# Altium project Dragonflyte.PrjPcb (part 1 of 2)
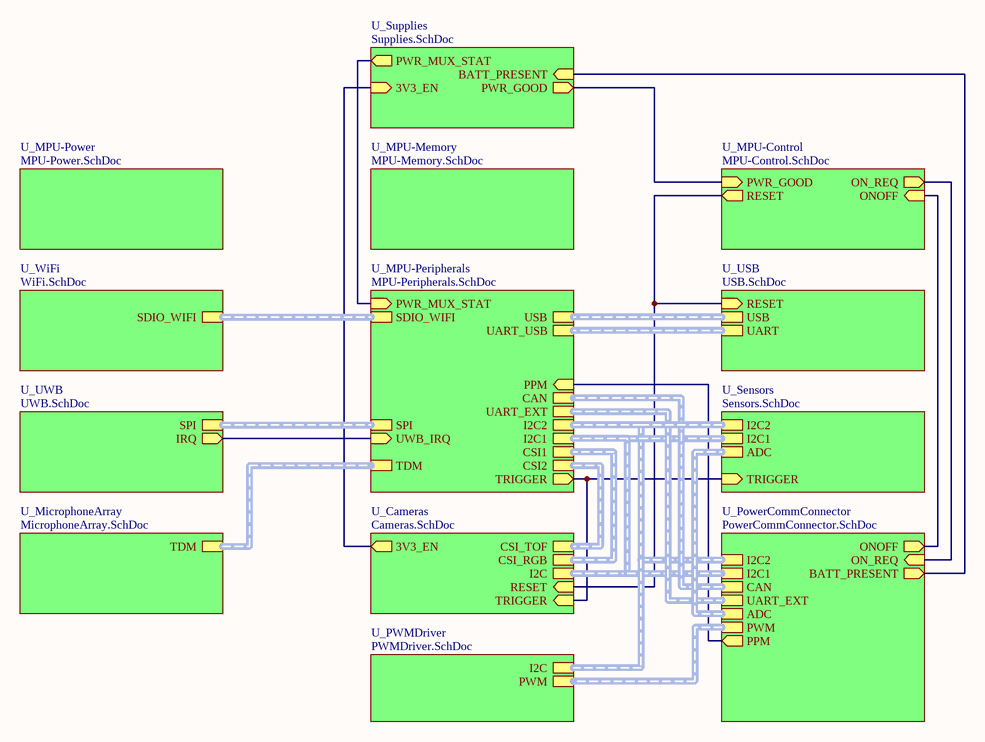
[diagram p0: Dragonflyte.SchDoc]
13 sheets, 238 parts. Net scope: hierarchical (ports join the sheet entries above them; power ports are global).
Board file: Dragonflyte.PcbDoc
Sheets:
  Dragonflyte.SchDoc
    U_Supplies = Supplies.SchDoc
    U_MPU-Memory = MPU-Memory.SchDoc
    U_MPU-Control = MPU-Control.SchDoc
    U_MPU-Peripherals = MPU-Peripherals.SchDoc
    U_WiFi = WiFi.SchDoc
    U_USB = USB.SchDoc
    U_Sensors = Sensors.SchDoc
    U_UWB = UWB.SchDoc
    U_MicrophoneArray = MicrophoneArray.SchDoc
    U_Cameras = Cameras.SchDoc
    U_PowerCommConnector = PowerCommConnector.SchDoc
    U_PWMDriver = PWMDriver.SchDoc

## Sheet Dragonflyte.SchDoc
size A; DocumentNumber: 1; SheetNumber: 1

### Sub-sheets
U_Cameras = Cameras.SchDoc: CSI_TOF (harness CSI12), I2C (harness I2C), CSI_RGB (harness CSI12), RESET (in), TRIGGER (in), 3V3_EN (out)
U_MicrophoneArray = MicrophoneArray.SchDoc: TDM (harness TDM)
U_MPU-Control = MPU-Control.SchDoc: PWR_GOOD (in), RESET (out), ON_REQ (out), ONOFF (in)
U_MPU-Memory = MPU-Memory.SchDoc: no entries
U_MPU-Peripherals = MPU-Peripherals.SchDoc: SDIO_WIFI (harness SDIO), UART_USB (harness UART), USB (harness USB), TDM (harness TDM), SPI (harness SPI), CSI1 (harness CSI12), I2C2 (harness I2C), I2C1 (harness I2C), CSI2 (harness CSI12), UWB_IRQ (in), PWR_MUX_STAT (in), TRIGGER (out), UART_EXT (harness UART), CAN (harness CAN), PPM (in)
U_MPU-Power = MPU-Power.SchDoc (file not in this document): no entries
U_PowerCommConnector = PowerCommConnector.SchDoc: ONOFF (out), ON_REQ (in), I2C1 (harness I2C), I2C2 (harness I2C), BATT_PRESENT (out), UART_EXT (harness UART), CAN (harness CAN), ADC (harness ADC), PWM (harness PWM), PPM (out)
U_PWMDriver = PWMDriver.SchDoc: I2C (harness I2C), PWM (harness PWM)
U_Sensors = Sensors.SchDoc: I2C1 (harness I2C), I2C2 (harness I2C), ADC (harness ADC), TRIGGER (in)
U_Supplies = Supplies.SchDoc: PWR_GOOD (out), PWR_MUX_STAT (out), BATT_PRESENT (in), 3V3_EN (in)
U_USB = USB.SchDoc: RESET (in), USB (harness USB), UART (harness UART)
U_UWB = UWB.SchDoc: SPI (harness SPI), IRQ (out)
U_WiFi = WiFi.SchDoc: SDIO_WIFI (harness SDIO)

### Nets
PWR_GOOD: sheet U_Supplies/PWR_GOOD, sheet U_MPU-Control/PWR_GOOD
RESET: sheet U_MPU-Control/RESET, sheet U_USB/RESET, sheet U_Cameras/RESET
TRIGGER: sheet U_MPU-Peripherals/TRIGGER, sheet U_Sensors/TRIGGER, sheet U_Cameras/TRIGGER
NetJP3_6: sheet U_Supplies/BATT_PRESENT, sheet U_PowerCommConnector/BATT_PRESENT
NetJP3_11: sheet U_MPU-Peripherals/PPM, sheet U_PowerCommConnector/PPM
NetJP3_30: sheet U_MPU-Control/ON_REQ, sheet U_PowerCommConnector/ON_REQ
NetJP3_31: sheet U_MPU-Control/ONOFF, sheet U_PowerCommConnector/ONOFF
NetR38_1: sheet U_Supplies/PWR_MUX_STAT, sheet U_MPU-Peripherals/PWR_MUX_STAT
NetU1_A16: sheet U_MPU-Peripherals/UWB_IRQ, sheet U_UWB/IRQ
NetU7_9: sheet U_Supplies/3V3_EN, sheet U_Cameras/3V3_EN

### Buses and harness runs
harness sheet U_Cameras/CSI_RGB = sheet U_MPU-Peripherals/CSI1
harness sheet U_Cameras/CSI_TOF = sheet U_MPU-Peripherals/CSI2
harness sheet U_Cameras/I2C = sheet U_MPU-Peripherals/I2C1 = sheet U_PowerCommConnector/I2C1 = sheet U_Sensors/I2C1
harness sheet U_MicrophoneArray/TDM = sheet U_MPU-Peripherals/TDM
harness sheet U_MPU-Peripherals/CAN = sheet U_PowerCommConnector/CAN
harness sheet U_MPU-Peripherals/I2C2 = sheet U_PowerCommConnector/I2C2 = sheet U_PWMDriver/I2C = sheet U_Sensors/I2C2
harness sheet U_MPU-Peripherals/SDIO_WIFI = sheet U_WiFi/SDIO_WIFI
harness sheet U_MPU-Peripherals/SPI = sheet U_UWB/SPI
harness sheet U_MPU-Peripherals/UART_EXT = sheet U_PowerCommConnector/UART_EXT
harness sheet U_MPU-Peripherals/UART_USB = sheet U_USB/UART
harness sheet U_MPU-Peripherals/USB = sheet U_USB/USB
harness sheet U_PowerCommConnector/ADC = sheet U_Sensors/ADC
harness sheet U_PowerCommConnector/PWM = sheet U_PWMDriver/PWM

## Sheet Supplies.SchDoc
size A; DocumentNumber: 6; SheetNumber: 6
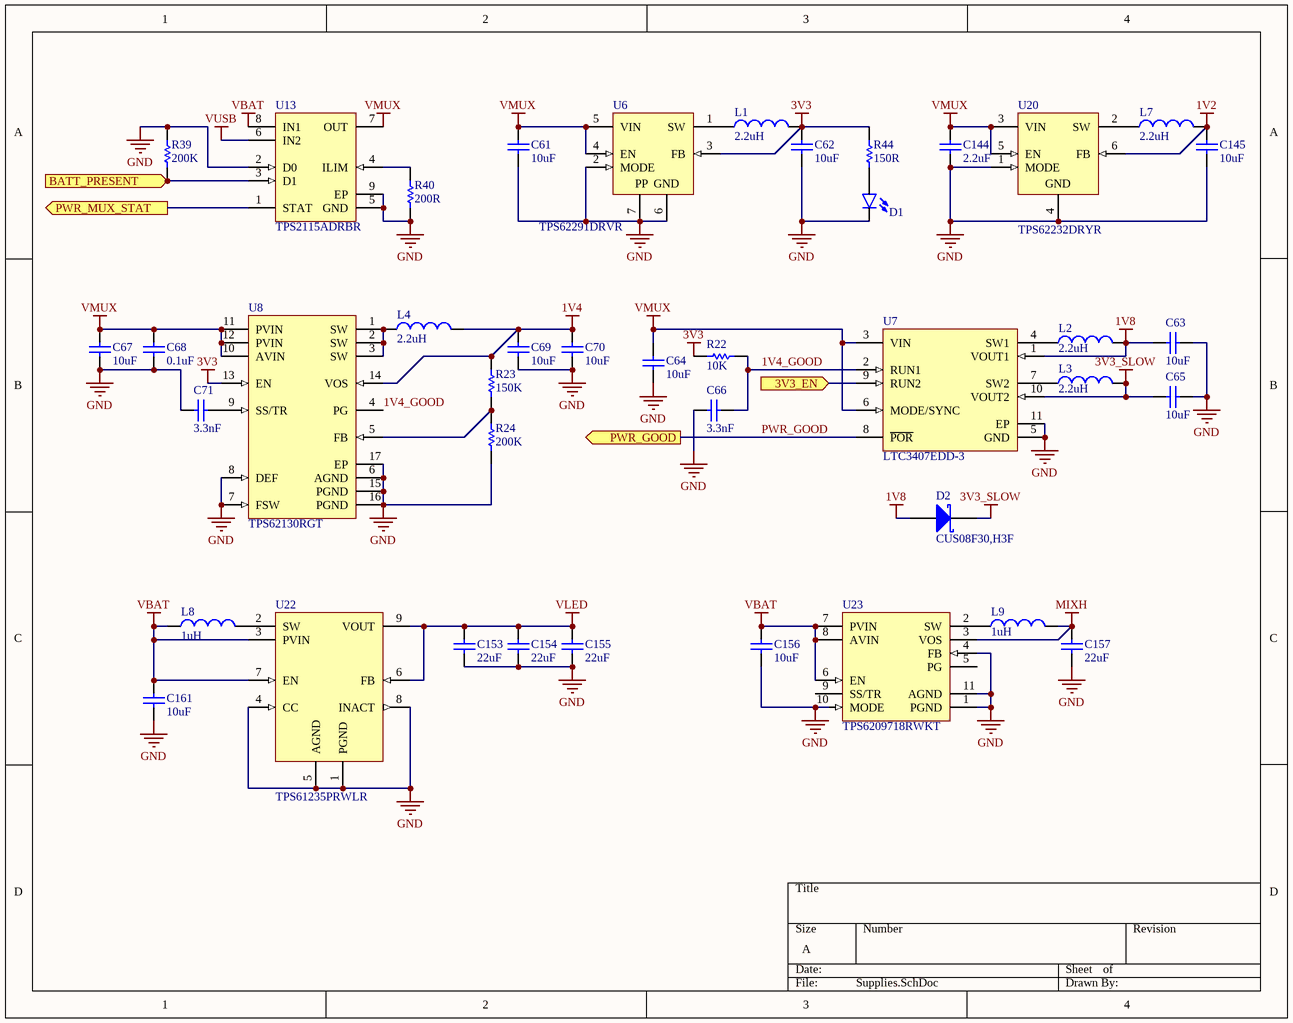
[diagram p1: Supplies.SchDoc]

### Parts
C61  value 10uF  [C0402[1005X55]]  (hidden comment: 10uF 6.3V 0402)
C62  value 10uF  [C0402[1005X55]]  (hidden comment: 10uF 6.3V 0402)
C63  value 10uF  [C0402[1005X55]]  (hidden comment: 10uF 6.3V 0402)
C64  value 10uF  [C0402[1005X55]]  (hidden comment: 10uF 6.3V 0402)
C65  value 10uF  [C0402[1005X55]]  (hidden comment: 10uF 6.3V 0402)
C66  value 3.3nF  [C0402[1005X55]]  (hidden comment: 3.3nF 50V 0402)
C67  value 10uF  [C0402[1005X55]]  (hidden comment: 10uF 6.3V 0402)
C68  value 0.1uF  [C0402[1005X55]]  (hidden comment: 0.1uF 6.3V 0402)
C69  value 10uF  [C0402[1005X55]]  (hidden comment: 10uF 6.3V 0402)
C70  value 10uF  [C0402[1005X55]]  (hidden comment: 10uF 6.3V 0402)
C71  value 3.3nF  [C0402[1005X55]]  (hidden comment: 3.3nF 50V 0402)
C144  value 2.2uF  [C0402[1005X55]]  (hidden comment: 2.2uF 6.3V 0402)
C145  value 10uF  [C0402[1005X55]]  (hidden comment: 10uF 6.3V 0402)
C153  value 22uF  [C0603[1608X92]]  (hidden comment: 22uF 6.3V 0603)
C154  value 22uF  [C0603[1608X92]]  (hidden comment: 22uF 6.3V 0603)
C155  value 22uF  [C0603[1608X92]]  (hidden comment: 22uF 6.3V 0603)
C156  value 10uF  [C0402[1005X55]]  (hidden comment: 10uF 6.3V 0402)
C157  value 22uF  [C0603[1608X92]]  (hidden comment: 22uF 6.3V 0603)
C161  value 10uF  [C0402[1005X55]]  (hidden comment: 10uF 6.3V 0402)
D1  LED_0603_BLUE_5mA  [LED0603]  (value not drawn)
D2  CUS08F30,H3F  [SOD-323]
L1  2.2uH  [IND0805]
L2  2.2uH  [IND0603]
L3  2.2uH  [IND0603]
L4  2.2uH  [IND1008]
L7  2.2uH  [IND0603]
L8  1uH  [IND1008]
L9  1uH  [IND0805]
R22  value 10K  [R0402[1005]]  (hidden comment: 10K 1% 0402)
R23  value 150K  [R0402[1005]]  (hidden comment: 150K 1% 0402)
R24  value 200K  [R0402[1005]]  (hidden comment: 200K 1% 0402)
R39  value 200K  [R0402[1005]]  (hidden comment: 200K 1% 0402)
R40  value 200R  [R0402[1005]]  (hidden comment: 200R 1% 0402)
R44  value 150R  [R0402[1005]]  (hidden comment: 150R 1% 0402)
U6  TPS62291DRVR  [WSON-6]
U7  LTC3407EDD-3  [VSON-10 (3mmx3mm)]
U8  TPS62130RGT  [QFN-16]
U13  TPS2115ADRBR  [VSON-8 (3x3MM)]
U20  TPS62232DRYR  [USON-6]
U22  TPS61235PRWLR  [VQFN-9]
U23  TPS6209718RWKT  [VQFN-11]

### Ports
3V3_EN (in), BATT_PRESENT (in), PWR_GOOD (out), PWR_MUX_STAT (out)

### Nets
1V2: C145.2 L7.2 U20.6(FB)
1V4: C69.2 C70.2 L4.2 R23.2 U8.14(VOS)
1V8: C63.2 D2.2(A) L2.2 U7.1(VOUT1)
3V3: C62.2 L1.2 R22.1 R44.2 U6.3(FB) U8.13(EN)
3V3_SLOW: C65.1 D2.1(K) L3.2 U7.10(VOUT2)
GND: C61.1 C62.1 C63.1 C64.1 C65.2 C66.1 C67.1 C68.1 C69.1 C70.1 C71.1 C144.1 C145.1 C153.1 C154.1 C155.1 C156.1 C157.1 C161.1 D1.C R24.1 R39.2 R40.1 U6.2(MODE) U6.6(GND) U6.7(EP) U7.5(GND) U7.11(EP) U8.6(AGND) U8.7(FSW) U8.8(DEF) U8.15(PGND) U8.16(PGND) U8.17(EP) U13.2(D0) U13.5(GND) U13.9(EP) U20.1(MODE) U20.4(GND) U22.1(PGND) U22.4(CC) U22.5(AGND) U22.8(INACT) U23.1(PGND) U23.4(FB) U23.10(MODE) U23.11(AGND)
MIXH: C157.2 L9.2 U23.3(VOS)
VBAT: C156.2 C161.2 L8.1 U13.8(IN1) U22.3(PVIN) U22.7(EN) U23.6(EN) U23.7(PVIN) U23.8(AVIN)
VLED: C153.2 C154.2 C155.2 U22.6(FB) U22.9(VOUT)
VMUX: C61.2 C64.2 C67.2 C68.2 C144.2 U6.4(EN) U6.5(VIN) U7.3(VIN) U7.6(MODE/SYNC) U8.10(AVIN) U8.11(PVIN) U8.12(PVIN) U13.7(OUT) U20.3(VIN) U20.5(EN)
VUSB: U13.6(IN2)
1V4_GOOD: C66.2 R22.2 U7.2(RUN1) U8.4(PG)
PWR_GOOD: U7.8(~{POR}) ; port PWR_GOOD
NetC71_2: C71.2 U8.9(SS/TR)
NetD1_A: D1.A R44.1
NetJP3_6: R39.1 U13.3(D1) ; port BATT_PRESENT
NetL1_1: L1.1 U6.1(SW)
NetL2_1: L2.1 U7.4(SW1)
NetL3_1: L3.1 U7.7(SW2)
NetL4_1: L4.1 U8.1(SW) U8.2(SW) U8.3(SW)
NetL7_1: L7.1 U20.2(SW)
NetL8_2: L8.2 U22.2(SW)
NetL9_1: L9.1 U23.2(SW)
NetR23_1: R23.1 R24.2 U8.5(FB)
NetR38_1: U13.1(STAT) ; port PWR_MUX_STAT
NetR40_2: R40.2 U13.4(ILIM)
NetU7_9: U7.9(RUN2) ; port 3V3_EN

Not connected (* = marked no-connect by the designer): U23 5(PG) 9(SS/TR)

### Notes on the sheet
- (in symbol TPS62291DRVR) PP

### Library data of the parts
C61-C65 C67 C69 C70 C145 C156 C161 = CAP_10uF_6.3V_0402_20%: 10uF 6.3V 20% 0402 (1005 Metric); PartNumber: GRM155R60J106ME44D; Manufacturer: Murata; Tolerance: 20%; Mounting Technology: Surface Mount; PackageReference: 0402; PackageDescription: 0402 (1005 Metric); Voltage: 6.3V
C66 C71 = CAP_3.3nF_50V_0402_10%: 3.3nF 50V 10% 0402 (1005 Metric); PartNumber: GRM155R71H332KA01D; Manufacturer: Murata; Mounting Technology: Surface Mount; PackageReference: 0402; PackageDescription: 0402 (1005 Metric); Voltage: 50V; Tolerance: 10%
C68 = CAP_0.1uF_6.3V_0402_10%: 0.1uF 6.3V 10% 0402 (1005 Metric); PartNumber: GRM155R70J104KA01D; Manufacturer: Murata; Mounting Technology: Surface Mount; PackageReference: 0402; PackageDescription: 0402 (1005 Metric); Voltage: 6.3V; Tolerance: 10%
C144 = CAP_2.2uF_6.3V_0402_20%: 2.2uF 6.3V 20% 0402 (1005 Metric); PartNumber: GRM155R60J225ME15D; Manufacturer: Murata; Mounting Technology: Surface Mount; PackageReference: 0402; PackageDescription: 0402 (1005 Metric); Voltage: 6.3V; Tolerance: 20%
C153-C155 C157 = CAP_22uF_6.3V_0603_10%: 22uF 6.3V 10% 0603 (1608 Metric); PartNumber: GRT188R60J226ME13D; Manufacturer: Murata; Mounting Technology: Surface Mount; PackageReference: 0603; PackageDescription: 0603 (1608 Metric); Voltage: 6.3V; Tolerance: 10%
D1 = LED_0603_BLUE_5mA: PartNumber: LTST-C193TBKT-5A; Manufacturer: Lite-On Inc.; PackageReference: 0603; PackageDescription: 0603 (1608 Metric); Mounting Technology: Surface Mount
D2 = CUS08F30,H3F: Manufacturer: Toshiba; PackageReference: SOD-323; PartNumber: CUS08F30,H3F; Mounting Technology: Surface Mount
L1 = IND_2.2uH_1.7A_0805_20%: 2.2uH 20% 1.7A 0805; PartNumber: LQM21PN2R2MGHL; Manufacturer: Murata; PackageReference: 0805; PackageDescription: 0805 (2012 metric); Value: 2.2uH; Mounting Technology: Surface Mount; Current: 1.7A
L2 L3 L7 = IND_2.2uH_750mA_0603_20%: 2.2uH 20% 750mA 0603; PartNumber: LQM18PZ2R2MCHD; Manufacturer: Murata; PackageReference: 0603; PackageDescription: 0603 (1608 metric); Value: 2.2uH; Mounting Technology: Surface Mount; Current: 750mA
L4 = IND_2.2uH_3.3A_1008_20%: 2.2uH 20% 3.3A 1008; PartNumber: DFE252012F-2R2M=P2; Manufacturer: Murata; PackageReference: 1008; PackageDescription: 1008 (2520 metric); Mounting Technology: Surface Mount; Current: 3.3A; Value: 2.2uH
L8 = IND_1uH_4.7A_1008_20%: 1uH 20% 4.7A 1008; PartNumber: DFE252012F-2R2M=P2; Manufacturer: Murata; PackageReference: 1008; PackageDescription: 1008 (2520 metric); Mounting Technology: Surface Mount; Current: 4.7A; Value: 1uH
L9 = IND_1uH_2.3A_0805_20%: 1uH 20% 2.3A 0805; PartNumber: DFE201210S-1R0M=P2; Manufacturer: Murata; PackageReference: 0805; PackageDescription: 0805 (2012 metric); Mounting Technology: Surface Mount; Current: 2.3A; Value: 1uH
R22 = RES_10K_0402_1%: 10K 0.063W 1% 0402 (1005 Metric); Manufacturer: KOA Speer; PartNumber: RK73H1ETTP1002F; Tolerance: 1%; Power: 0.063W; Mounting Technology: Surface Mount; PackageReference: 0402; PackageDescription: 0402 (1005 Metric); ComponentLink1Description: Datasheet; ComponentLink1URL: http://www.koaspeer.com/catimages/Products/RK73H/RK73H.pdf
R23 = RES_150K_0402_1%: 150K 0.063W 1% 0402 (1005 Metric); Manufacturer: KOA Speer; PartNumber: RK73H1ETTP1503F; Tolerance: 1%; Power: 0.063W; Mounting Technology: Surface Mount; PackageReference: 0402; PackageDescription: 0402 (1005 Metric); ComponentLink1Description: Datasheet; ComponentLink1URL: http://www.koaspeer.com/catimages/Products/RK73H/RK73H.pdf
R24 R39 = RES_200K_0402_1%: 200K 0.063W 1% 0402 (1005 Metric); Manufacturer: KOA Speer; PartNumber: RK73H1ETTP2003F; Tolerance: 1%; Power: 0.063W; Mounting Technology: Surface Mount; PackageReference: 0402; PackageDescription: 0402 (1005 Metric); ComponentLink1Description: Datasheet; ComponentLink1URL: http://www.koaspeer.com/catimages/Products/RK73H/RK73H.pdf
R40 = RES_200R_0402_1%: 200R 0.063W 1% 0402 (1005 Metric); Manufacturer: KOA Speer; PartNumber: RK73H1ETTP2000F; Tolerance: 1%; Power: 0.063W; Mounting Technology: Surface Mount; PackageReference: 0402; PackageDescription: 0402 (1005 Metric); ComponentLink1Description: Datasheet; ComponentLink1URL: http://www.koaspeer.com/catimages/Products/RK73H/RK73H.pdf
R44 = RES_150R_0402_1%: 150R 0.063W 1% 0402 (1005 Metric); Manufacturer: KOA Speer; PartNumber: RK73H1ETTP1500F; Tolerance: 1%; Power: 0.063W; Mounting Technology: Surface Mount; PackageReference: 0402; PackageDescription: 0402 (1005 Metric); ComponentLink1Description: Datasheet; ComponentLink1URL: http://www.koaspeer.com/catimages/Products/RK73H/RK73H.pdf
U6 = TPS62291DRVR: Voltage Regulators - Switching Regulators 2.25MHz 1A Step-Down Cnvrtr 3.3V Output; Manufacturer: Texas Instruments; PartNumber: TPS62291DRVR; PackageReference: WSON-6; PackageDescription: SON, 6-Leads, Body 2x2mm, Pitch 0.65mm, Thermal Pad 1.6x1mm, TI Recommended; Mounting Technology: Surface Mount
U7 = LTC3407EDD-3: Manufacturer: Linear Technology; PartNumber: LTC3407EDD-3; PackageReference: SON-10; Mounting Technology: Surface Mount
U8 = TPS62130RGT: Manufacturer: Texas Instruments; PartNumber: TPS62130RGT; PackageReference: QFN-16; Mounting Technology: Surface Mount
U13 = TPS2115ADRBR: Power Switch ICs - Power Distribution Autoswitching Pwr Mux; Manufacturer: Texas Instruments; PartNumber: TPS2115ADRBR; PackageReference: VSON-8; Mounting Technology: Surface Mount
U20 = TPS62232DRYR: Switching Voltage Regulators 3 MHz Ultra Small Step Down Converter; Manufacturer: Texas Instruments; PartNumber: TPS62232DRYR; PackageReference: USON-6; Mounting Technology: Surface Mount
U22 = TPS61235PRWLR: Manufacturer: Texas Instruments; PartNumber: TPS61235PRWLR; PackageReference: VQFN-9; Mounting Technology: Surface Mount
U23 = TPS6209718RWKT: TPS62097 2-A High Efficiency Step-Down Converter with iDCS Control, Forced PWM Mode and Selective Switching Frequency; Manufacturer: Texas Instruments; PartNumber: TPS6209718RWKT; Mounting Technology: Surface Mount; PackageReference: VQFN-11

## Sheet MPU-Memory.SchDoc
size C; DocumentNumber: 3; SheetNumber: 3
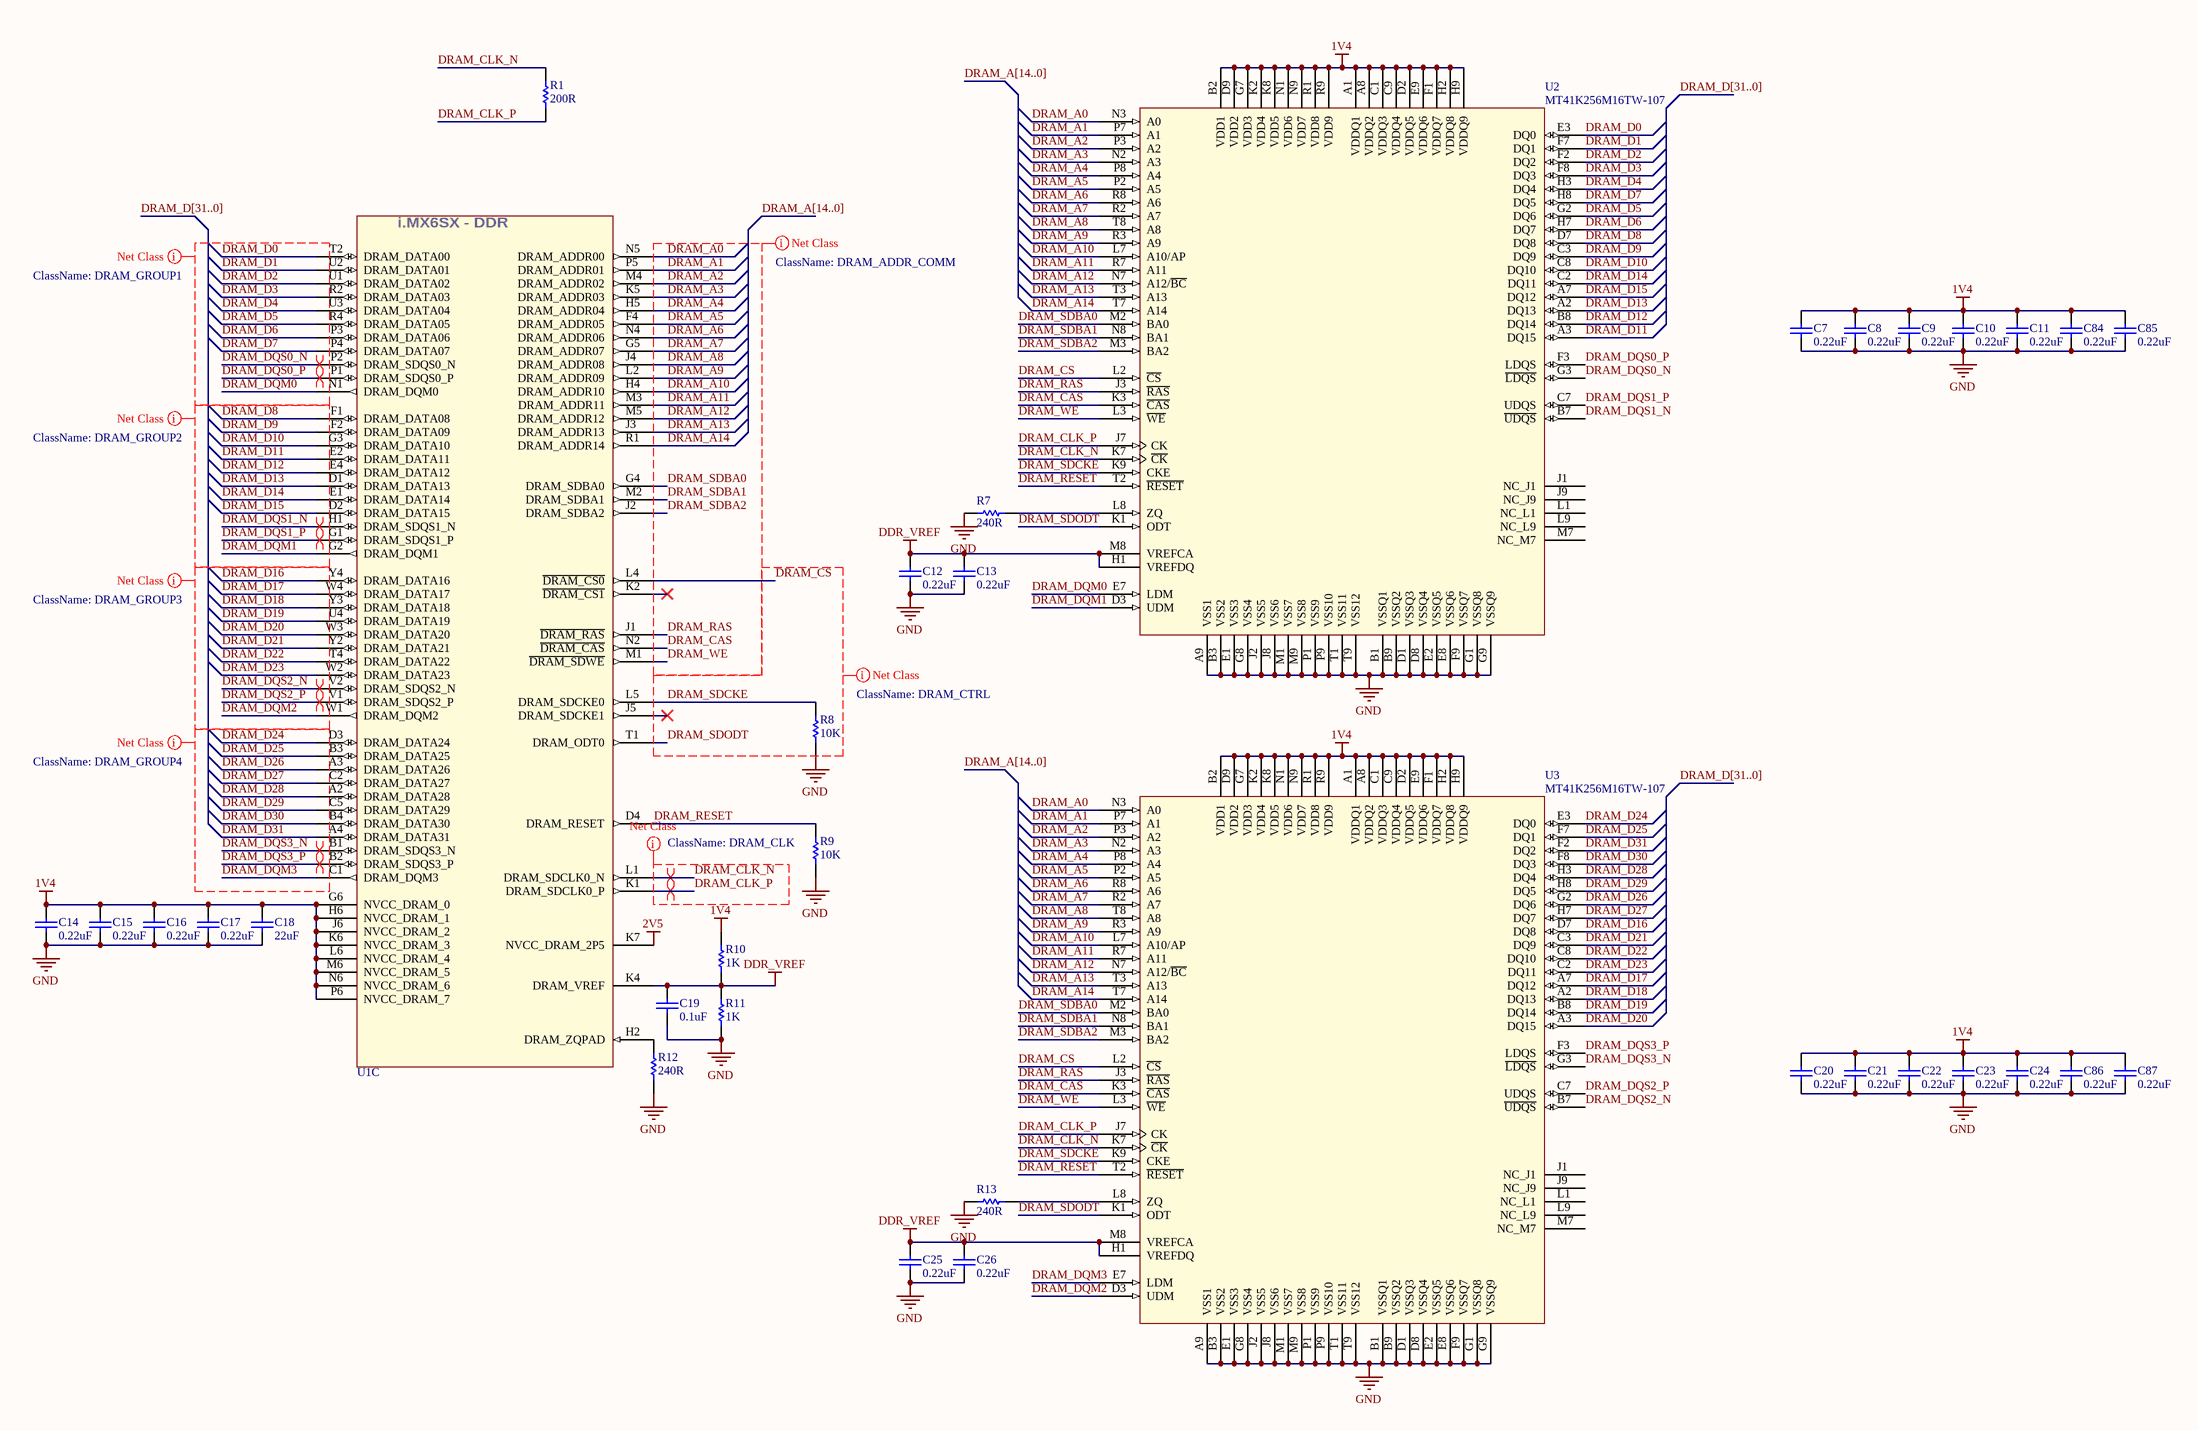
[diagram p2: MPU-Memory.SchDoc]

### Parts
C7  value 0.22uF  [C0402[1005X55]]  (hidden comment: 0.22uF 6.3V 0402)
C8  value 0.22uF  [C0402[1005X55]]  (hidden comment: 0.22uF 6.3V 0402)
C9  value 0.22uF  [C0402[1005X55]]  (hidden comment: 0.22uF 6.3V 0402)
C10  value 0.22uF  [C0402[1005X55]]  (hidden comment: 0.22uF 6.3V 0402)
C11  value 0.22uF  [C0402[1005X55]]  (hidden comment: 0.22uF 6.3V 0402)
C12  value 0.22uF  [C0402[1005X55]]  (hidden comment: 0.22uF 6.3V 0402)
C13  value 0.22uF  [C0402[1005X55]]  (hidden comment: 0.22uF 6.3V 0402)
C14  value 0.22uF  [C0402[1005X55]]  (hidden comment: 0.22uF 6.3V 0402)
C15  value 0.22uF  [C0402[1005X55]]  (hidden comment: 0.22uF 6.3V 0402)
C16  value 0.22uF  [C0402[1005X55]]  (hidden comment: 0.22uF 6.3V 0402)
C17  value 0.22uF  [C0402[1005X55]]  (hidden comment: 0.22uF 6.3V 0402)
C18  value 22uF  [C0603[1608X92]]  (hidden comment: 22uF 6.3V 0603)
C19  value 0.1uF  [C0402[1005X55]]  (hidden comment: 0.1uF 6.3V 0402)
C20  value 0.22uF  [C0402[1005X55]]  (hidden comment: 0.22uF 6.3V 0402)
C21  value 0.22uF  [C0402[1005X55]]  (hidden comment: 0.22uF 6.3V 0402)
C22  value 0.22uF  [C0402[1005X55]]  (hidden comment: 0.22uF 6.3V 0402)
C23  value 0.22uF  [C0402[1005X55]]  (hidden comment: 0.22uF 6.3V 0402)
C24  value 0.22uF  [C0402[1005X55]]  (hidden comment: 0.22uF 6.3V 0402)
C25  value 0.22uF  [C0402[1005X55]]  (hidden comment: 0.22uF 6.3V 0402)
C26  value 0.22uF  [C0402[1005X55]]  (hidden comment: 0.22uF 6.3V 0402)
C84  value 0.22uF  [C0402[1005X55]]  (hidden comment: 0.22uF 6.3V 0402)
C85  value 0.22uF  [C0402[1005X55]]  (hidden comment: 0.22uF 6.3V 0402)
C86  value 0.22uF  [C0402[1005X55]]  (hidden comment: 0.22uF 6.3V 0402)
C87  value 0.22uF  [C0402[1005X55]]  (hidden comment: 0.22uF 6.3V 0402)
R1  value 200R  [R0402[1005]]  (hidden comment: 200R 1% 0402)
R7  value 240R  [R0402[1005]]  (hidden comment: 240R 1% 0402)
R8  value 10K  [R0402[1005]]  (hidden comment: 10K 1% 0402)
R9  value 10K  [R0402[1005]]  (hidden comment: 10K 1% 0402)
R10  value 1K  [R0402[1005]]  (hidden comment: 1K 1% 0402)
R11  value 1K  [R0402[1005]]  (hidden comment: 1K 1% 0402)
R12  value 240R  [R0402[1005]]  (hidden comment: 240R 1% 0402)
R13  value 240R  [R0402[1005]]  (hidden comment: 240R 1% 0402)
U1  MCIMX6X3EVO10AB  [BGA-400]  (value not drawn)  (part C of 12)
U2  MT41K256M16TW-107  [BGA-96]
U3  MT41K256M16TW-107  [BGA-96]

### Nets
1V4: C7.2 C8.2 C9.2 C10.2 C11.2 C14.2 C15.2 C16.2 C17.2 C18.2 C20.2 C21.2 C22.2 C23.2 C24.2 C84.2 C85.2 C86.2 C87.2 R10.2 U1.G6(NVCC_DRAM_0) U1.H6(NVCC_DRAM_1) U1.J6(NVCC_DRAM_2) U1.K6(NVCC_DRAM_3) U1.L6(NVCC_DRAM_4) U1.M6(NVCC_DRAM_5) U1.N6(NVCC_DRAM_6) U1.P6(NVCC_DRAM_7) U2.A1(VDDQ1) U2.A8(VDDQ2) U2.B2(VDD1) U2.C1(VDDQ3) U2.C9(VDDQ4) U2.D2(VDDQ5) U2.D9(VDD2) U2.E9(VDDQ6) U2.F1(VDDQ7) U2.G7(VDD3) U2.H2(VDDQ8) U2.H9(VDDQ9) U2.K2(VDD4) U2.K8(VDD5) U2.N1(VDD6) U2.N9(VDD7) U2.R1(VDD8) U2.R9(VDD9) U3.A1(VDDQ1) U3.A8(VDDQ2) U3.B2(VDD1) U3.C1(VDDQ3) U3.C9(VDDQ4) U3.D2(VDDQ5) U3.D9(VDD2) U3.E9(VDDQ6) U3.F1(VDDQ7) U3.G7(VDD3) U3.H2(VDDQ8) U3.H9(VDDQ9) U3.K2(VDD4) U3.K8(VDD5) U3.N1(VDD6) U3.N9(VDD7) U3.R1(VDD8) U3.R9(VDD9)
2V5: U1.K7(NVCC_DRAM_2P5)
DDR_VREF: C12.2 C13.2 C19.2 C25.2 C26.2 R10.1 R11.2 U1.K4(DRAM_VREF) U2.H1(VREFDQ) U2.M8(VREFCA) U3.H1(VREFDQ) U3.M8(VREFCA)
GND: C7.1 C8.1 C9.1 C10.1 C11.1 C12.1 C13.1 C14.1 C15.1 C16.1 C17.1 C18.1 C19.1 C20.1 C21.1 C22.1 C23.1 C24.1 C25.1 C26.1 C84.1 C85.1 C86.1 C87.1 R7.2 R8.1 R9.1 R11.1 R12.1 R13.2 U2.A9(VSS1) U2.B1(VSSQ1) U2.B3(VSS2) U2.B9(VSSQ2) U2.D1(VSSQ3) U2.D8(VSSQ4) U2.E1(VSS3) U2.E2(VSSQ5) U2.E8(VSSQ6) U2.F9(VSSQ7) U2.G1(VSSQ8) U2.G8(VSS4) U2.G9(VSSQ9) U2.J2(VSS5) U2.J8(VSS6) U2.M1(VSS7) U2.M9(VSS8) U2.P1(VSS9) U2.P9(VSS10) U2.T1(VSS11) U2.T9(VSS12) U3.A9(VSS1) U3.B1(VSSQ1) U3.B3(VSS2) U3.B9(VSSQ2) U3.D1(VSSQ3) U3.D8(VSSQ4) U3.E1(VSS3) U3.E2(VSSQ5) U3.E8(VSSQ6) U3.F9(VSSQ7) U3.G1(VSSQ8) U3.G8(VSS4) U3.G9(VSSQ9) U3.J2(VSS5) U3.J8(VSS6) U3.M1(VSS7) U3.M9(VSS8) U3.P1(VSS9) U3.P9(VSS10) U3.T1(VSS11) U3.T9(VSS12)
DRAM_A0: U1.N5(DRAM_ADDR00) U2.N3(A0) U3.N3(A0)
DRAM_A1: U1.P5(DRAM_ADDR01) U2.P7(A1) U3.P7(A1)
DRAM_A2: U1.M4(DRAM_ADDR02) U2.P3(A2) U3.P3(A2)
DRAM_A3: U1.K5(DRAM_ADDR03) U2.N2(A3) U3.N2(A3)
DRAM_A4: U1.H5(DRAM_ADDR04) U2.P8(A4) U3.P8(A4)
DRAM_A5: U1.F4(DRAM_ADDR05) U2.P2(A5) U3.P2(A5)
DRAM_A6: U1.N4(DRAM_ADDR06) U2.R8(A6) U3.R8(A6)
DRAM_A7: U1.G5(DRAM_ADDR07) U2.R2(A7) U3.R2(A7)
DRAM_A8: U1.J4(DRAM_ADDR08) U2.T8(A8) U3.T8(A8)
DRAM_A9: U1.L2(DRAM_ADDR09) U2.R3(A9) U3.R3(A9)
DRAM_A10: U1.H4(DRAM_ADDR10) U2.L7(A10/AP) U3.L7(A10/AP)
DRAM_A11: U1.M3(DRAM_ADDR11) U2.R7(A11) U3.R7(A11)
DRAM_A12: U1.M5(DRAM_ADDR12) U2.N7(A12/~{BC}) U3.N7(A12/~{BC})
DRAM_A13: U1.J3(DRAM_ADDR13) U2.T3(A13) U3.T3(A13)
DRAM_A14: U1.R1(DRAM_ADDR14) U2.T7(A14) U3.T7(A14)
DRAM_CAS: U1.N2(~{DRAM_CAS}) U2.K3(~{CAS}) U3.K3(~{CAS})
DRAM_CLK_N: R1.2 U1.L1(DRAM_SDCLK0_N) U2.K7(~{CK}) U3.K7(~{CK})
DRAM_CLK_P: R1.1 U1.K1(DRAM_SDCLK0_P) U2.J7(CK) U3.J7(CK)
DRAM_CS: U1.L4(~{DRAM_CS0}) U2.L2(~{CS}) U3.L2(~{CS})
DRAM_D0: U1.T2(DRAM_DATA00) U2.E3(DQ0)
DRAM_D1: U1.U2(DRAM_DATA01) U2.F7(DQ1)
DRAM_D2: U1.U1(DRAM_DATA02) U2.F2(DQ2)
DRAM_D3: U1.R2(DRAM_DATA03) U2.F8(DQ3)
DRAM_D4: U1.U3(DRAM_DATA04) U2.H3(DQ4)
DRAM_D5: U1.R4(DRAM_DATA05) U2.G2(DQ6)
DRAM_D6: U1.P3(DRAM_DATA06) U2.H7(DQ7)
DRAM_D7: U1.P4(DRAM_DATA07) U2.H8(DQ5)
DRAM_D8: U1.F1(DRAM_DATA08) U2.D7(DQ8)
DRAM_D9: U1.F2(DRAM_DATA09) U2.C3(DQ9)
DRAM_D10: U1.G3(DRAM_DATA10) U2.C8(DQ10)
DRAM_D11: U1.E2(DRAM_DATA11) U2.A3(DQ15)
DRAM_D12: U1.E4(DRAM_DATA12) U2.B8(DQ14)
DRAM_D13: U1.D1(DRAM_DATA13) U2.A2(DQ13)
DRAM_D14: U1.E1(DRAM_DATA14) U2.C2(DQ11)
DRAM_D15: U1.D2(DRAM_DATA15) U2.A7(DQ12)
DRAM_D16: U1.Y4(DRAM_DATA16) U3.D7(DQ8)
DRAM_D17: U1.W4(DRAM_DATA17) U3.A7(DQ12)
DRAM_D18: U1.Y3(DRAM_DATA18) U3.A2(DQ13)
DRAM_D19: U1.U4(DRAM_DATA19) U3.B8(DQ14)
DRAM_D20: U1.W3(DRAM_DATA20) U3.A3(DQ15)
DRAM_D21: U1.Y2(DRAM_DATA21) U3.C3(DQ9)
DRAM_D22: U1.T4(DRAM_DATA22) U3.C8(DQ10)
DRAM_D23: U1.W2(DRAM_DATA23) U3.C2(DQ11)
DRAM_D24: U1.D3(DRAM_DATA24) U3.E3(DQ0)
DRAM_D25: U1.B3(DRAM_DATA25) U3.F7(DQ1)
DRAM_D26: U1.A3(DRAM_DATA26) U3.G2(DQ6)
DRAM_D27: U1.C2(DRAM_DATA27) U3.H7(DQ7)
DRAM_D28: U1.A2(DRAM_DATA28) U3.H3(DQ4)
DRAM_D29: U1.C5(DRAM_DATA29) U3.H8(DQ5)
DRAM_D30: U1.B4(DRAM_DATA30) U3.F8(DQ3)
DRAM_D31: U1.A4(DRAM_DATA31) U3.F2(DQ2)
DRAM_DQM0: U1.N1(DRAM_DQM0) U2.E7(LDM)
DRAM_DQM1: U1.G2(DRAM_DQM1) U2.D3(UDM)
DRAM_DQM2: U1.W1(DRAM_DQM2) U3.D3(UDM)
DRAM_DQM3: U1.C1(DRAM_DQM3) U3.E7(LDM)
DRAM_DQS0_N: U1.P2(DRAM_SDQS0_N) U2.G3(~{LDQS})
DRAM_DQS0_P: U1.P1(DRAM_SDQS0_P) U2.F3(LDQS)
DRAM_DQS1_N: U1.H1(DRAM_SDQS1_N) U2.B7(~{UDQS})
DRAM_DQS1_P: U1.G1(DRAM_SDQS1_P) U2.C7(UDQS)
DRAM_DQS2_N: U1.V2(DRAM_SDQS2_N) U3.B7(~{UDQS})
DRAM_DQS2_P: U1.V1(DRAM_SDQS2_P) U3.C7(UDQS)
DRAM_DQS3_N: U1.B1(DRAM_SDQS3_N) U3.G3(~{LDQS})
DRAM_DQS3_P: U1.B2(DRAM_SDQS3_P) U3.F3(LDQS)
DRAM_RAS: U1.J1(~{DRAM_RAS}) U2.J3(~{RAS}) U3.J3(~{RAS})
DRAM_RESET: R9.2 U1.D4(DRAM_RESET) U2.T2(~{RESET}) U3.T2(~{RESET})
DRAM_SDBA0: U1.G4(DRAM_SDBA0) U2.M2(BA0) U3.M2(BA0)
DRAM_SDBA1: U1.M2(DRAM_SDBA1) U2.N8(BA1) U3.N8(BA1)
DRAM_SDBA2: U1.J2(DRAM_SDBA2) U2.M3(BA2) U3.M3(BA2)
DRAM_SDCKE: R8.2 U1.L5(DRAM_SDCKE0) U2.K9(CKE) U3.K9(CKE)
DRAM_SDODT: U1.T1(DRAM_ODT0) U2.K1(ODT) U3.K1(ODT)
DRAM_WE: U1.M1(~{DRAM_SDWE}) U2.L3(~{WE}) U3.L3(~{WE})
NetR7_1: R7.1 U2.L8(ZQ)
NetR12_2: R12.2 U1.H2(DRAM_ZQPAD)
NetR13_1: R13.1 U3.L8(ZQ)

Not connected (* = marked no-connect by the designer): U1 J5(DRAM_SDCKE1)* K2(~{DRAM_CS1})*; U2 J1(NC_J1) J9(NC_J9) L1(NC_L1) L9(NC_L9) M7(NC_M7); U3 J1(NC_J1) J9(NC_J9) L1(NC_L1) L9(NC_L9) M7(NC_M7)

### Buses and harness runs
bus DRAM_A[14..0]
bus DRAM_D[31..0]

### Layout directives
differential pair: DRAM_CLK_N, DRAM_CLK_P, DRAM_DQS0_N, DRAM_DQS0_P, DRAM_DQS1_N, DRAM_DQS1_P, DRAM_DQS2_N, DRAM_DQS2_P, DRAM_DQS3_N, DRAM_DQS3_P
net class DRAM_GROUP1: DRAM_D0, DRAM_D1, DRAM_D2, DRAM_D3, DRAM_D4, DRAM_D5, DRAM_D6, DRAM_D7, DRAM_DQM0, DRAM_DQS0_N, DRAM_DQS0_P
net class DRAM_GROUP2: DRAM_D8, DRAM_D9, DRAM_D10, DRAM_D11, DRAM_D12, DRAM_D13, DRAM_D14, DRAM_D15, DRAM_DQM1, DRAM_DQS1_N, DRAM_DQS1_P
net class DRAM_GROUP3: DRAM_D16, DRAM_D17, DRAM_D18, DRAM_D19, DRAM_D20, DRAM_D21, DRAM_D22, DRAM_D23, DRAM_DQM2, DRAM_DQS2_N, DRAM_DQS2_P
net class DRAM_GROUP4: DRAM_D24, DRAM_D25, DRAM_D26, DRAM_D27, DRAM_D28, DRAM_D29, DRAM_D30, DRAM_D31, DRAM_DQM3, DRAM_DQS3_N, DRAM_DQS3_P
net class DRAM_ADDR_COMM: DRAM_A0, DRAM_A1, DRAM_A2, DRAM_A3, DRAM_A4, DRAM_A5, DRAM_A6, DRAM_A7, DRAM_A8, DRAM_A9, DRAM_A10, DRAM_A11, DRAM_A12, DRAM_A13, DRAM_A14, DRAM_CAS, DRAM_RAS, DRAM_SDBA0, DRAM_SDBA1, DRAM_SDBA2, DRAM_WE
net class DRAM_CTRL: DRAM_CS, DRAM_SDCKE, DRAM_SDODT, GND
net class DRAM_CLK: DRAM_CLK_N, DRAM_CLK_P

### Notes on the sheet
- (in symbol MCIMX6X3EVO10AB, part C) i.MX6SX - DDR

### Library data of the parts
C7-C17 C20-C26 C84-C87 = CAP_0.22uF_6.3V_0402_10%: 0.22uF 6.3V 10% 0402 (1005 Metric); PartNumber: JMK105BJ224KV-F; Manufacturer: Taiyo Yuden; Mounting Technology: Surface Mount; PackageReference: 0402; PackageDescription: 0402 (1005 Metric); Voltage: 6.3V; Tolerance: 10%
C18 = CAP_22uF_6.3V_0603_10%: as C153 on sheet Supplies; Mounting Technology: Surface Mount; PackageReference: 0603; PackageDescription: 0603 (1608 Metric); Voltage: 6.3V; Tolerance: 10%
C19 = CAP_0.1uF_6.3V_0402_10%: as C68 on sheet Supplies; Mounting Technology: Surface Mount; PackageReference: 0402; PackageDescription: 0402 (1005 Metric); Voltage: 6.3V; Tolerance: 10%
R1 = RES_200R_0402_1%: as R40 on sheet Supplies; Tolerance: 1%; Power: 0.063W; Mounting Technology: Surface Mount; PackageReference: 0402; PackageDescription: 0402 (1005 Metric); ComponentLink1Description: Datasheet; ComponentLink1URL: http://www.koaspeer.com/catimages/Products/RK73H/RK73H.pdf
R7 R12 R13 = RES_240R_0402_1%: 240R 0.063W 1% 0402 (1005 Metric); Manufacturer: KOA Speer; PartNumber: RK73H1ETTP2400F; Tolerance: 1%; Power: 0.063W; Mounting Technology: Surface Mount; PackageReference: 0402; PackageDescription: 0402 (1005 Metric); ComponentLink1Description: Datasheet; ComponentLink1URL: http://www.koaspeer.com/catimages/Products/RK73H/RK73H.pdf
R8 R9 = RES_10K_0402_1%: as R22 on sheet Supplies; Tolerance: 1%; Power: 0.063W; Mounting Technology: Surface Mount; PackageReference: 0402; PackageDescription: 0402 (1005 Metric); ComponentLink1Description: Datasheet; ComponentLink1URL: http://www.koaspeer.com/catimages/Products/RK73H/RK73H.pdf
R10 R11 = RES_1K_0402_1%: 1K 0.063W 1% 0402 (1005 Metric); Manufacturer: KOA Speer; PartNumber: RK73H1ETTP1001F; Tolerance: 1%; Power: 0.063W; Mounting Technology: Surface Mount; PackageReference: 0402; PackageDescription: 0402 (1005 Metric); ComponentLink1Description: Datasheet; ComponentLink1URL: http://www.koaspeer.com/catimages/Products/RK73H/RK73H.pdf
U1 = MCIMX6X3EVO10AB: IC MPU I.MX6SX 1GHZ 400MAPBGA; Manufacturer: NXP; PartNumber: MCIMX6X3EVO10AB; Mounting Technology: Surface Mount; PackageReference: BGA-400
U2 U3 = MT41K256M16TW-107: IC SDRAM 4GBIT 933MHZ 96FBGA; Manufacturer: Micron Technology; PartNumber: MT41K256M16TW-107; Mounting Technology: Surface Mount; PackageReference: BGA-96

## Sheet MPU-Control.SchDoc
size A; DocumentNumber: 4; SheetNumber: 4
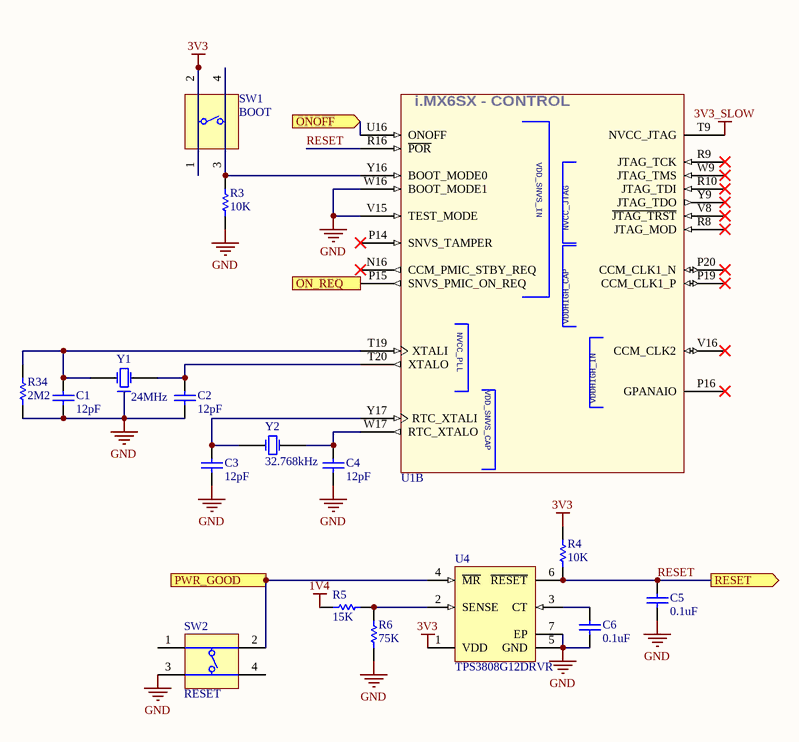
[diagram p3: MPU-Control.SchDoc]

### Parts
C1  value 12pF  [C0402[1005X55]]  (hidden comment: 12pF 50V 0402)
C2  value 12pF  [C0402[1005X55]]  (hidden comment: 12pF 50V 0402)
C3  value 12pF  [C0402[1005X55]]  (hidden comment: 12pF 50V 0402)
C4  value 12pF  [C0402[1005X55]]  (hidden comment: 12pF 50V 0402)
C5  value 0.1uF  [C0402[1005X55]]  (hidden comment: 0.1uF 6.3V 0402)
C6  value 0.1uF  [C0402[1005X55]]  (hidden comment: 0.1uF 100V 0402)
R3  value 10K  [R0402[1005]]  (hidden comment: 10K 1% 0402)
R4  value 10K  [R0402[1005]]  (hidden comment: 10K 1% 0402)
R5  value 15K  [R0402[1005]]  (hidden comment: 15K 1% 0402)
R6  value 75K  [R0402[1005]]  (hidden comment: 75K 1% 0402)
R34  value 2M2  [R0402[1005]]  (hidden comment: 2M2 1% 0402)
SW1  BOOT  [SWITCH]
SW2  RESET  [SWITCH]
U1  MCIMX6X3EVO10AB  [BGA-400]  (value not drawn)  (part B of 12)
U4  TPS3808G12DRVR  [WSON-6]
Y1  24MHz  [CRYSTAL_2.0x1.6]
Y2  32.768kHz  [CRYSTAL_2.0x1.2]

### Ports
ON_REQ (out), ONOFF (in), PWR_GOOD (in), RESET (out)

### Nets
1V4: R5.2
3V3: R4.2 SW1.1(T1) SW1.2(T2) U4.1(VDD)
3V3_SLOW: U1.T9(NVCC_JTAG)
GND: C1.1 C2.1 C3.1 C4.1 C5.1 C6.1 R3.1 R6.1 R34.1 SW2.3(T3) U1.V15(TEST_MODE) U1.W16(BOOT_MODE1) U4.5(GND) U4.7(EP) Y1.2
PWR_GOOD: SW2.2(T2) U4.4(~{MR}) ; port PWR_GOOD
RESET: C5.2 R4.1 U1.R16(~{POR}) U4.6(~{RESET}) ; port RESET
NetC1_2: C1.2 R34.2 U1.T19(XTALI) Y1.1(X1)
NetC2_2: C2.2 U1.T20(XTALO) Y1.3(X2)
NetC3_2: C3.2 U1.Y17(RTC_XTALI) Y2.1(X1)
NetC4_2: C4.2 U1.W17(RTC_XTALO) Y2.2(X2)
NetC6_2: C6.2 U4.3(CT)
NetJP3_30: U1.P15(SNVS_PMIC_ON_REQ) ; port ON_REQ
NetJP3_31: U1.U16(ONOFF) ; port ONOFF
NetR3_2: R3.2 SW1.3(T3) SW1.4(T3) U1.Y16(BOOT_MODE0)
NetR5_1: R5.1 R6.2 U4.2(SENSE)

Not connected (* = marked no-connect by the designer): SW2 1(T1) 4(T3); U1 N16(CCM_PMIC_STBY_REQ)* P14(SNVS_TAMPER)* P16(GPANAIO)* P19(CCM_CLK1_P)* P20(CCM_CLK1_N)* R8(JTAG_MOD)* R9(JTAG_TCK)* R10(JTAG_TDI)* V8(~{JTAG_TRST})* V16(CCM_CLK2)* W9(JTAG_TMS)* Y9(JTAG_TDO)*

### Notes on the sheet
- (in symbol MCIMX6X3EVO10AB, part B) i.MX6SX - CONTROL; VDDHIGH_CAP; VDDHIGH_IN

### Library data of the parts
C1-C4 = CAP_12pF_50V_0402_5%: 12pF 50V 5% 0402 (1005 Metric); PartNumber: GRM1555C1H120JA01D; Manufacturer: Murata; Mounting Technology: Surface Mount; PackageReference: 0402; PackageDescription: 0402 (1005 Metric); Voltage: 50V; Tolerance: 5%
C5 = CAP_0.1uF_6.3V_0402_10%: as C68 on sheet Supplies; Mounting Technology: Surface Mount; PackageReference: 0402; PackageDescription: 0402 (1005 Metric); Voltage: 6.3V; Tolerance: 10%
C6 = CAP_0.1uF_100V_0402_10%: 0.1uF 100V 10% 0402 (1005 Metric); PartNumber: GRM155R62A104KE14D; Manufacturer: Murata; Mounting Technology: Surface Mount; PackageReference: 0402; PackageDescription: 0402 (1005 Metric); Voltage: 100V; Tolerance: 10%
R3 R4 = RES_10K_0402_1%: as R22 on sheet Supplies; Tolerance: 1%; Power: 0.063W; Mounting Technology: Surface Mount; PackageReference: 0402; PackageDescription: 0402 (1005 Metric); ComponentLink1Description: Datasheet; ComponentLink1URL: http://www.koaspeer.com/catimages/Products/RK73H/RK73H.pdf
R5 = RES_15K_0402_1%: 15K 0.063W 1% 0402 (1005 Metric); Manufacturer: KOA Speer; PartNumber: RK73H1ETTP1502F; Tolerance: 1%; Power: 0.063W; Mounting Technology: Surface Mount; PackageReference: 0402; PackageDescription: 0402 (1005 Metric); ComponentLink1Description: Datasheet; ComponentLink1URL: http://www.koaspeer.com/catimages/Products/RK73H/RK73H.pdf
R6 = RES_75K_0402_1%: 75K 0.063W 1% 0402 (1005 Metric); Manufacturer: KOA Speer; PartNumber: RK73H1ETTP7502F; Tolerance: 1%; Power: 0.063W; Mounting Technology: Surface Mount; PackageReference: 0402; PackageDescription: 0402 (1005 Metric); ComponentLink1Description: Datasheet; ComponentLink1URL: http://www.koaspeer.com/catimages/Products/RK73H/RK73H.pdf
R34 = RES_2M2_0402_1%: 2M2 0.063W 1% 0402 (1005 Metric); Manufacturer: KOA Speer; PartNumber: RK73H1ETTP2204F; Tolerance: 1%; Power: 0.063W; Mounting Technology: Surface Mount; PackageReference: 0402; PackageDescription: 0402 (1005 Metric); ComponentLink1Description: Datasheet; ComponentLink1URL: http://www.koaspeer.com/catimages/Products/RK73H/RK73H.pdf
SW1 SW2 = DIPT-DTSM-6: Switch, SPNO Push Button SMD; Manufacturer: C&K Components; PartNumber: PTS810 SJM 250 SMTR LFS; Packing Type: Tape&Reel; Mechanical Life: 200,000 cycles; ComponentLink2URL: http://www.dip.com.tw/Products_tact.htm; ComponentLink1URL: http://www.dip.com.tw/; ComponentLink3URL: http://www.dip.com.tw/PDF/pro_tact/DTSM_G_-6_2_-V.pdf; PackageDescription: Switch, Surface Mount, 4 Leads, Body 4.6x2.8mm, Height 1.9mm; ComponentLink2Description: Datasheet; ComponentLink3Description: Package Specification; ComponentLink1Description: Manufacturer URL; PackageReference: PTS810; Mounting Technology: Surface Mount
U1 = MCIMX6X3EVO10AB: as U1 on sheet MPU-Memory; PartNumber: MCIMX6X3EVO10AB; Mounting Technology: Surface Mount; PackageReference: BGA-400
U4 = TPS3808G12DRVR: Manufacturer: Texas Instruments; PackageReference: WSON-6; Mounting Technology: Surface Mount; PartNumber: TPS3808G12DRVR
Y1 = FA-128 24.0000MF10Z-W3: Manufacturer: EPSON; PartNumber: FA-128 24.0000MF10Z-W3; Mounting Technology: Surface Mount; PackageReference: 4-SMD
Y2 = ABS06-32.768KHZ-9-1-T: Manufacturer: Abracon; PartNumber: ABS06-32.768KHZ-9-1-T; Mounting Technology: Surface Mount; PackageReference: 4-SMD

## Sheet MPU-Peripherals.SchDoc
size C; DocumentNumber: 5; SheetNumber: 5
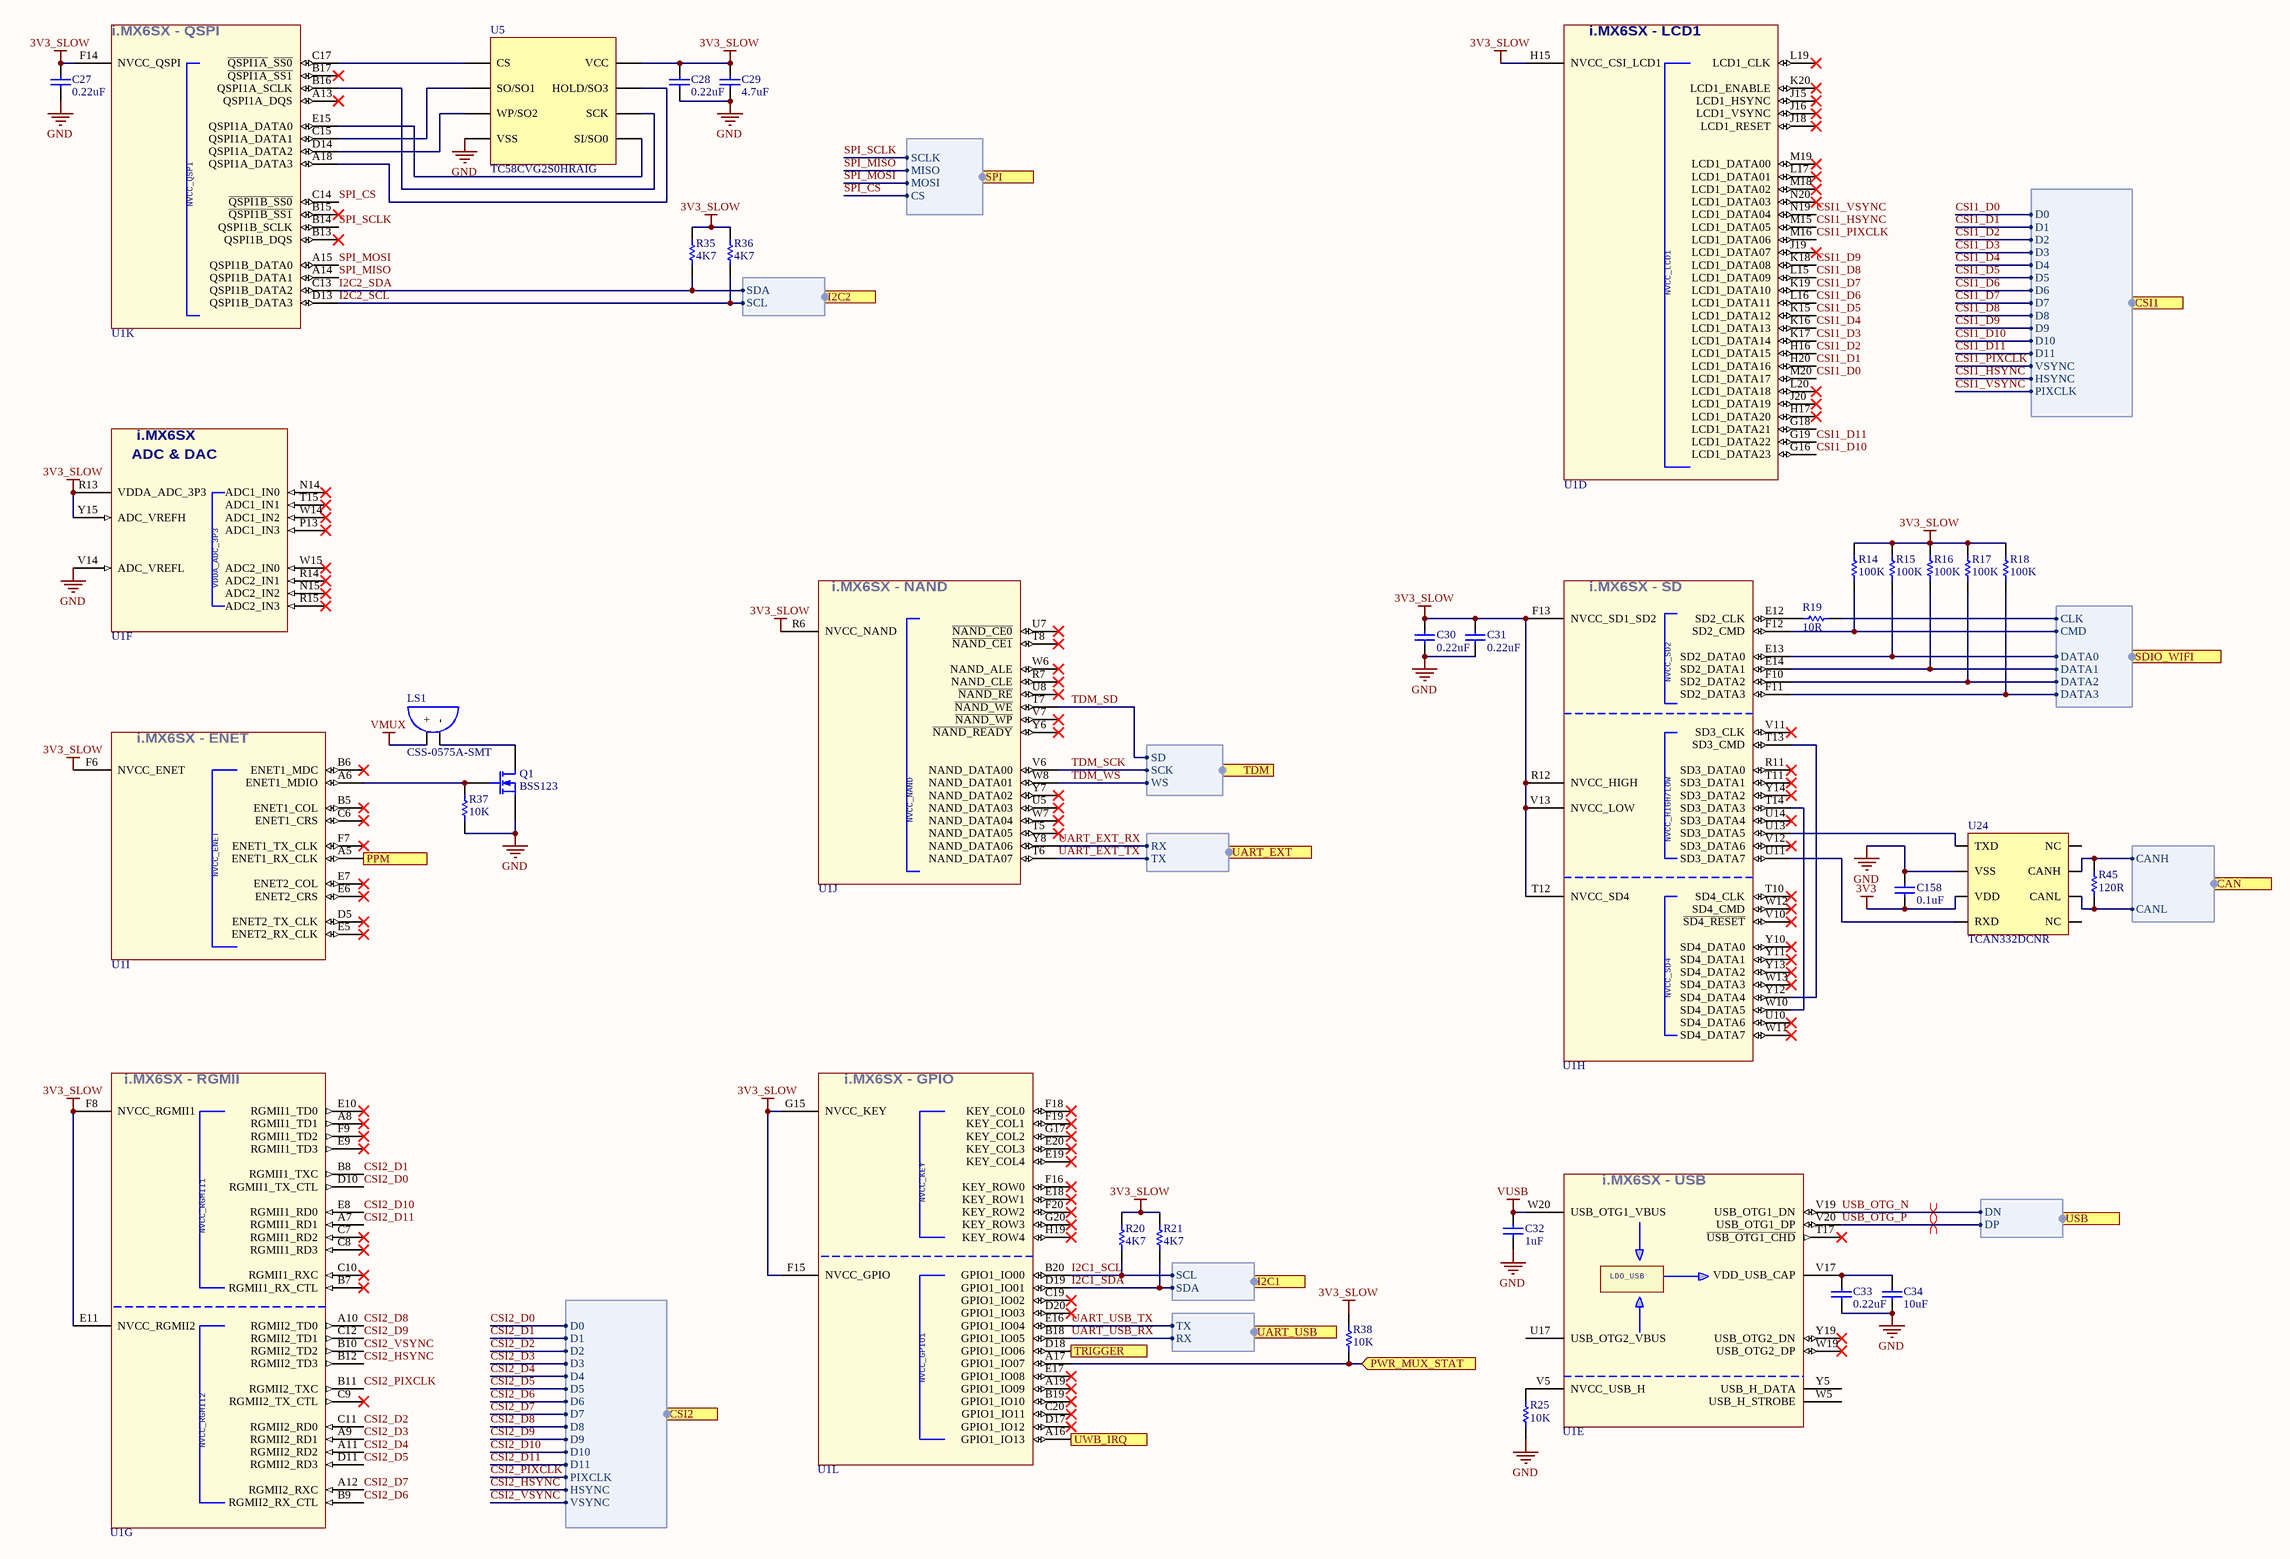
[diagram p4: MPU-Peripherals.SchDoc]

### Parts
C27  value 0.22uF  [C0402[1005X55]]  (hidden comment: 0.22uF 6.3V 0402)
C28  value 0.22uF  [C0402[1005X55]]  (hidden comment: 0.22uF 6.3V 0402)
C29  value 4.7uF  [C0402[1005X55]]  (hidden comment: 4.7uF 6.3V 0402)
C30  value 0.22uF  [C0402[1005X55]]  (hidden comment: 0.22uF 6.3V 0402)
C31  value 0.22uF  [C0402[1005X55]]  (hidden comment: 0.22uF 6.3V 0402)
C32  value 1uF  [C0402[1005X55]]  (hidden comment: 1uF 16V 0402)
C33  value 0.22uF  [C0402[1005X55]]  (hidden comment: 0.22uF 6.3V 0402)
C34  value 10uF  [C0402[1005X55]]  (hidden comment: 10uF 6.3V 0402)
C158  value 0.1uF  [C0402[1005X55]]  (hidden comment: 0.1uF 6.3V 0402)
LS1  CSS-0575A-SMT  [CSS-0575A-SMT]
Q1  BSS123  [SOT323-3]
R14  value 100K  [R0402[1005]]  (hidden comment: 100K 1% 0402)
R15  value 100K  [R0402[1005]]  (hidden comment: 100K 1% 0402)
R16  value 100K  [R0402[1005]]  (hidden comment: 100K 1% 0402)
R17  value 100K  [R0402[1005]]  (hidden comment: 100K 1% 0402)
R18  value 100K  [R0402[1005]]  (hidden comment: 100K 1% 0402)
R19  value 10R  [R0402[1005]]  (hidden comment: 10R 1% 0402)
R20  value 4K7  [R0402[1005]]  (hidden comment: 4K7 1% 0402)
R21  value 4K7  [R0402[1005]]  (hidden comment: 4K7 1% 0402)
R25  value 10K  [R0402[1005]]  (hidden comment: 10K 1% 0402)
R35  value 4K7  [R0402[1005]]  (hidden comment: 4K7 1% 0402)
R36  value 4K7  [R0402[1005]]  (hidden comment: 4K7 1% 0402)
R37  value 10K  [R0402[1005]]  (hidden comment: 10K 1% 0402)
R38  value 10K  [R0402[1005]]  (hidden comment: 10K 1% 0402)
R45  value 120R  [R0402[1005]]  (hidden comment: 120R 1% 0402)
U1  MCIMX6X3EVO10AB  [BGA-400]  (value not drawn)  (parts D,E,F,G,H,I,J,K,L of 12)
U5  TC58CVG2S0HRAIG  [WSON-8 (6X8MM)]
U24  TCAN332DCNR  [SOT-23-8]

### Ports
CAN (harness CAN), CSI1 (harness CSI12), CSI2 (harness CSI12), I2C1 (harness I2C), I2C2 (harness I2C), PPM (in), PWR_MUX_STAT (in), SDIO_WIFI (harness SDIO), SPI (harness SPI), TDM (harness TDM), TRIGGER (out), UART_EXT (harness UART), UART_USB (harness UART), USB (harness USB), UWB_IRQ (in)

### Harnesses
SDIO: CLK, CMD, DATA0, DATA1, DATA2, DATA3
CSI12: D2, D3, D1, D0, D6, D7, D5, D4, D10, D9, D8, PIXCLK, D11, HSYNC, VSYNC
I2C: SCL, SDA
UART: TX, RX
USB: DN, DP
SPI: SCLK, MISO, MOSI, CS
TDM: WS, SCK, SD
CAN: CANL, CANH

### Nets
3V3: C158.1 U24.3(VDD)
3V3_SLOW: C27.2 C28.2 C29.2 C30.2 C31.2 R14.2 R15.2 R16.2 R17.2 R18.2 R20.2 R21.2 R35.2 R36.2 R38.2 U1.E11(NVCC_RGMII2) U1.F6(NVCC_ENET) U1.F8(NVCC_RGMII1) U1.F13(NVCC_SD1_SD2) U1.F14(NVCC_QSPI) U1.F15(NVCC_GPIO) U1.G15(NVCC_KEY) U1.H15(NVCC_CSI_LCD1) U1.R6(NVCC_NAND) U1.R12(NVCC_HIGH) U1.R13(VDDA_ADC_3P3) U1.T12(NVCC_SD4) U1.V13(NVCC_LOW) U1.Y15(ADC_VREFH) U5.8(VCC)
GND: C27.1 C28.1 C29.1 C30.1 C31.1 C32.1 C33.1 C34.1 C158.2 Q1.2(S) R25.1 R37.1 U1.V14(ADC_VREFL) U5.4(VSS) U24.2(VSS)
VMUX: LS1.1(+)
VUSB: C32.2 U1.W20(USB_OTG1_VBUS)
CSI1_D0: U1.M20(LCD1_DATA17) ; port CSI1.D0
CSI1_D1: U1.H20(LCD1_DATA16) ; port CSI1.D1
CSI1_D2: U1.H16(LCD1_DATA15) ; port CSI1.D2
CSI1_D3: U1.K17(LCD1_DATA14) ; port CSI1.D3
CSI1_D4: U1.K16(LCD1_DATA13) ; port CSI1.D4
CSI1_D5: U1.K15(LCD1_DATA12) ; port CSI1.D5
CSI1_D6: U1.L16(LCD1_DATA11) ; port CSI1.D6
CSI1_D7: U1.K19(LCD1_DATA10) ; port CSI1.D7
CSI1_D8: U1.L15(LCD1_DATA09) ; port CSI1.D8
CSI1_D9: U1.K18(LCD1_DATA08) ; port CSI1.D9
CSI1_D10: U1.G16(LCD1_DATA23) ; port CSI1.D10
CSI1_D11: U1.G19(LCD1_DATA22) ; port CSI1.D11
CSI1_HSYNC: U1.M15(LCD1_DATA05) ; port CSI1.HSYNC
CSI1_PIXCLK: U1.M16(LCD1_DATA06) ; port CSI1.VSYNC
CSI1_VSYNC: U1.N19(LCD1_DATA04) ; port CSI1.PIXCLK
CSI2_D0: U1.D10(RGMII1_TX_CTL) ; port CSI2.D0
CSI2_D1: U1.B8(RGMII1_TXC) ; port CSI2.D1
CSI2_D2: U1.C11(RGMII2_RD0) ; port CSI2.D2
CSI2_D3: U1.A9(RGMII2_RD1) ; port CSI2.D3
CSI2_D4: U1.A11(RGMII2_RD2) ; port CSI2.D4
CSI2_D5: U1.D11(RGMII2_RD3) ; port CSI2.D5
CSI2_D6: U1.B9(RGMII2_RX_CTL) ; port CSI2.D6
CSI2_D7: U1.A12(RGMII2_RXC) ; port CSI2.D7
CSI2_D8: U1.A10(RGMII2_TD0) ; port CSI2.D8
CSI2_D9: U1.C12(RGMII2_TD1) ; port CSI2.D9
CSI2_D10: U1.E8(RGMII1_RD0) ; port CSI2.D10
CSI2_D11: U1.A7(RGMII1_RD1) ; port CSI2.D11
CSI2_HSYNC: U1.B12(RGMII2_TD3) ; port CSI2.HSYNC
CSI2_PIXCLK: U1.B11(RGMII2_TXC) ; port CSI2.PIXCLK
CSI2_VSYNC: U1.B10(RGMII2_TD2) ; port CSI2.VSYNC
I2C1_SCL: R20.1 U1.B20(GPIO1_IO00) ; port I2C1.SCL
I2C1_SDA: R21.1 U1.D19(GPIO1_IO01) ; port I2C1.SDA
I2C2_SCL: R36.1 U1.D13(QSPI1B_DATA3) ; port I2C2.SCL
I2C2_SDA: R35.1 U1.C13(QSPI1B_DATA2) ; port I2C2.SDA
SPI_CS: U1.C14(~{QSPI1B_SS0}) ; port SPI.CS
SPI_MISO: U1.A14(QSPI1B_DATA1) ; port SPI.MISO
SPI_MOSI: U1.A15(QSPI1B_DATA0) ; port SPI.MOSI
SPI_SCLK: U1.B14(QSPI1B_SCLK) ; port SPI.SCLK
TDM_SCK: U1.V6(NAND_DATA00) ; port TDM.SCK
TDM_SD: U1.T7(~{NAND_WE}) ; port TDM.SD
TDM_WS: U1.W8(NAND_DATA01) ; port TDM.WS
TRIGGER: U1.D18(GPIO1_IO06) ; port TRIGGER
UART_EXT_RX: U1.Y8(NAND_DATA06) ; port UART_EXT.RX
UART_EXT_TX: U1.T6(NAND_DATA07) ; port UART_EXT.TX
UART_USB_RX: U1.B18(GPIO1_IO05) ; port UART_USB.RX
UART_USB_TX: U1.E16(GPIO1_IO04) ; port UART_USB.TX
USB_OTG_N: U1.V19(USB_OTG1_DN) ; port USB.DN
USB_OTG_P: U1.V20(USB_OTG1_DP) ; port USB.DP
NetC33_2: C33.2 C34.2 U1.V17(VDD_USB_CAP)
NetJP3_9: R45.1 U24.6(CANL) ; port CAN.CANL
NetJP3_10: R45.2 U24.7(CANH) ; port CAN.CANH
NetJP3_11: U1.A5(ENET1_RX_CLK) ; port PPM
NetLS1_2: LS1.2(-) Q1.3(D)
NetQ1_1: Q1.1(G) R37.2 U1.A6(ENET1_MDIO)
NetR14_1: R14.1 U1.F12(SD2_CMD) ; port SDIO_WIFI.CMD
NetR15_1: R15.1 U1.E13(SD2_DATA0) ; port SDIO_WIFI.DATA0
NetR16_1: R16.1 U1.E14(SD2_DATA1) ; port SDIO_WIFI.DATA1
NetR17_1: R17.1 U1.F10(SD2_DATA2) ; port SDIO_WIFI.DATA2
NetR18_1: R18.1 U1.F11(SD2_DATA3) ; port SDIO_WIFI.DATA3
NetR19_1: R19.1 U1.E12(SD2_CLK)
NetR19_2: R19.2 ; port SDIO_WIFI.CLK
NetR25_2: R25.2 U1.V5(NVCC_USB_H)
NetR38_1: R38.1 U1.A17(GPIO1_IO07) ; port PWR_MUX_STAT
NetU1_A16: U1.A16(GPIO1_IO13) ; port UWB_IRQ
NetU1_A18: U1.A18(QSPI1A_DATA3) U5.7(HOLD/SO3)
NetU1_B16: U1.B16(QSPI1A_SCLK) U5.6(SCK)
NetU1_C15: U1.C15(QSPI1A_DATA1) U5.2(SO/SO1)
NetU1_C17: U1.C17(~{QSPI1A}_~{SS0}) U5.1(CS)
NetU1_D14: U1.D14(QSPI1A_DATA2) U5.3(WP/SO2)
NetU1_E15: U1.E15(QSPI1A_DATA0) U5.5(SI/SO0)
NetU1_T13: U1.T13(SD3_CMD) U1.Y12(SD4_DATA4)
NetU1_T14: U1.T14(SD3_DATA3) U1.W10(SD4_DATA5)
NetU1_U11: U1.U11(SD3_DATA7) U24.4(RXD)
NetU1_U13: U1.U13(SD3_DATA5) U24.1(TXD)

Not connected (* = marked no-connect by the designer): U1 A8(RGMII1_TD1)* A13(QSPI1A_DQS)* A19(GPIO1_IO09)* B5(ENET1_COL)* B6(ENET1_MDC)* B7(RGMII1_RX_CTL)* B13(QSPI1B_DQS)* B15(~{QSPI1B_SS1})* B17(~{QSPI1A_SS1})* B19(GPIO1_IO10)* C6(ENET1_CRS)* C7(RGMII1_RD2)* C8(RGMII1_RD3)* C9(RGMII2_TX_CTL)* C10(RGMII1_RXC)* C19(GPIO1_IO02)* C20(GPIO1_IO11)* D5(ENET2_TX_CLK)* D17(GPIO1_IO12)* D20(GPIO1_IO03)* E5(ENET2_RX_CLK)* E6(ENET2_CRS)* E7(ENET2_COL)* E9(RGMII1_TD3)* E10(RGMII1_TD0)* E17(GPIO1_IO08)* E18(KEY_ROW1)* E19(KEY_COL4)* E20(KEY_COL3)* F7(ENET1_TX_CLK)* F9(RGMII1_TD2)* F16(KEY_ROW0)* F18(KEY_COL0)* F19(KEY_COL1)* F20(KEY_ROW2)* G17(KEY_COL2)* G18(LCD1_DATA21) G20(KEY_ROW3)* H17(LCD1_DATA20)* H19(KEY_ROW4)* J15(LCD1_HSYNC)* J16(LCD1_VSYNC)* J18(LCD1_RESET)* J19(LCD1_DATA07)* J20(LCD1_DATA19)* K20(LCD1_ENABLE)* L17(LCD1_DATA01)* L19(LCD1_CLK)* L20(LCD1_DATA18)* M18(LCD1_DATA02)* M19(LCD1_DATA00)* N14(ADC1_IN0)* N15(ADC2_IN2)* N20(LCD1_DATA03)* P13(ADC1_IN3)* R7(NAND_CLE)* R11(SD3_DATA0)* R14(ADC2_IN1)* R15(ADC2_IN3)* T5(NAND_DATA05)* T8(~{NAND_CE1})* T10(SD4_CLK)* T11(SD3_DATA1)* T15(ADC1_IN1)* T17(~{USB_OTG1_CHD})* U5(NAND_DATA03)* U7(~{NAND_CE0})* U8(~{NAND_RE})* U10(SD4_DATA6)* U14(SD3_DATA4)* U17(USB_OTG2_VBUS) V7(~{NAND_WP})* V10(~{SD4_RESET})* V11(SD3_CLK)* V12(SD3_DATA6)* W5(USB_H_STROBE) W6(NAND_ALE)* W7(NAND_DATA04)* W11(SD4_DATA7)* W12(SD4_CMD)* W13(SD4_DATA3)* W14(ADC1_IN2)* W15(ADC2_IN0)* W19(USB_OTG2_DP)* Y5(USB_H_DATA) Y6(~{NAND_READY})* Y7(NAND_DATA02)* Y10(SD4_DATA0)* Y11(SD4_DATA1)* Y13(SD4_DATA2)* Y14(SD3_DATA2)* Y19(USB_OTG2_DN)*; U24 5(NC) 8(NC)

### Layout directives
differential pair: USB_OTG_N, USB_OTG_P

### Notes on the sheet
- (in symbol MCIMX6X3EVO10AB, part D) i.MX6SX - LCD1; NVCC_LCD1
- (in symbol MCIMX6X3EVO10AB, part E) i.MX6SX - USB; LDO_USB
- (in symbol MCIMX6X3EVO10AB, part F) i.MX6SX; ADC & DAC
- (in symbol MCIMX6X3EVO10AB, part G) i.MX6SX - RGMII
- (in symbol MCIMX6X3EVO10AB, part H) i.MX6SX - SD; NVCC_SD2; NVCC_HIGH/LOW
- (in symbol MCIMX6X3EVO10AB, part I) i.MX6SX - ENET
- (in symbol MCIMX6X3EVO10AB, part J) i.MX6SX - NAND
- (in symbol MCIMX6X3EVO10AB, part K) i.MX6SX - QSPI
- (in symbol MCIMX6X3EVO10AB, part L) i.MX6SX - GPIO; NVCC_GPIO1

### Library data of the parts
C27 C28 C30 C31 C33 = CAP_0.22uF_6.3V_0402_10%: as C7 on sheet MPU-Memory; Mounting Technology: Surface Mount; PackageReference: 0402; PackageDescription: 0402 (1005 Metric); Voltage: 6.3V; Tolerance: 10%
C29 = CAP_4.7uF_6.3V_0402_20%: 4.7uF 6.3V 20% 0402 (1005 Metric); PartNumber: GRM155R60J475ME47D; Manufacturer: Murata; Mounting Technology: Surface Mount; PackageReference: 0402; PackageDescription: 0402 (1005 Metric); Voltage: 6.3V; Tolerance: 20%
C32 = CAP_1uF_16V_0402_10%: 1uF 16V 10% 0402 (1005 Metric); PartNumber: GRM155R61C105KE01D; Manufacturer: Murata; Mounting Technology: Surface Mount; PackageReference: 0402; PackageDescription: 0402 (1005 Metric); Voltage: 16V; Tolerance: 10%
C34 = CAP_10uF_6.3V_0402_20%: as C61 on sheet Supplies; Mounting Technology: Surface Mount; PackageReference: 0402; PackageDescription: 0402 (1005 Metric); Voltage: 6.3V; Tolerance: 20%
C158 = CAP_0.1uF_6.3V_0402_10%: as C68 on sheet Supplies; Mounting Technology: Surface Mount; PackageReference: 0402; PackageDescription: 0402 (1005 Metric); Voltage: 6.3V; Tolerance: 10%
LS1 = CSS-0575A-SMT: Magnetic Buzzer Transducer; Manufacturer: CUI, Inc.; PartNumber: CSS-0575A-SMT; Mounting Technology: Surface Mount; PackageReference: 5x5x1.9mm
Q1 = BSS123WQ-7-F: N-Channel MOSFET; Manufacturer: Diodes Incorporated; PackageReference: SOT-323-3; PartNumber: BSS123WQ-7-F; Mounting Technology: Surface Mount
R14-R18 = RES_100K_0402_1%: 100K 0.063W 1% 0402 (1005 Metric); Manufacturer: KOA Speer; PartNumber: RK73H1ETTP1003F; Tolerance: 1%; Power: 0.063W; Mounting Technology: Surface Mount; PackageReference: 0402; PackageDescription: 0402 (1005 Metric); ComponentLink1Description: Datasheet; ComponentLink1URL: http://www.koaspeer.com/catimages/Products/RK73H/RK73H.pdf
R19 = RES_10R_0402_1%: 10R 0.063W 1% 0402 (1005 Metric); Manufacturer: KOA Speer; PartNumber: RK73H1ETTP10R0F; Tolerance: 1%; Power: 0.063W; Mounting Technology: Surface Mount; PackageReference: 0402; PackageDescription: 0402 (1005 Metric); ComponentLink1Description: Datasheet; ComponentLink1URL: http://www.koaspeer.com/catimages/Products/RK73H/RK73H.pdf
R20 R21 R35 R36 = RES_4K7_0402_1%: 4K7 0.063W 1% 0402 (1005 Metric); Manufacturer: KOA Speer; PartNumber: RK73H1ETTP4701F; Tolerance: 1%; Power: 0.063W; Mounting Technology: Surface Mount; PackageReference: 0402; PackageDescription: 0402 (1005 Metric); ComponentLink1Description: Datasheet; ComponentLink1URL: http://www.koaspeer.com/catimages/Products/RK73H/RK73H.pdf
R25 R37 R38 = RES_10K_0402_1%: as R22 on sheet Supplies; Tolerance: 1%; Power: 0.063W; Mounting Technology: Surface Mount; PackageReference: 0402; PackageDescription: 0402 (1005 Metric); ComponentLink1Description: Datasheet; ComponentLink1URL: http://www.koaspeer.com/catimages/Products/RK73H/RK73H.pdf
R45 = RES_120R_0402_1%: 120R 0.063W 1% 0402 (1005 Metric); Manufacturer: KOA Speer; PartNumber: RK73H1ETTP1200F; Tolerance: 1%; Power: 0.063W; Mounting Technology: Surface Mount; PackageReference: 0402; PackageDescription: 0402 (1005 Metric); ComponentLink1Description: Datasheet; ComponentLink1URL: http://www.koaspeer.com/catimages/Products/RK73H/RK73H.pdf
U1 = MCIMX6X3EVO10AB: as U1 on sheet MPU-Memory; PartNumber: MCIMX6X3EVO10AB; Mounting Technology: Surface Mount; PackageReference: BGA-400
U5 = TC58CVG2S0HRAIG: IC FLASH 4G SPI 104MHZ 8WSON; pin to pad: 4>4+9; Manufacturer: Toshiba Memory America, Inc.; PartNumber: TC58CVG2S0HRAIG; Mounting Technology: Surface Mount; PackageReference: WSON-8
U24 = TCAN332DCNR: CAN Interface IC 3.3-V CAN Transceivers with CAN FD (Flexible Data Rate) 8-SOT-23 -40 to 125; Manufacturer: Texas Instruments; Mounting Technology: Surface Mount; PackageReference: SOT-23-8; PackageDescription: SOT23, 8-Leads; PartNumber: TCAN332DCNR

## Sheet WiFi.SchDoc
size A; DocumentNumber: 7; SheetNumber: 7
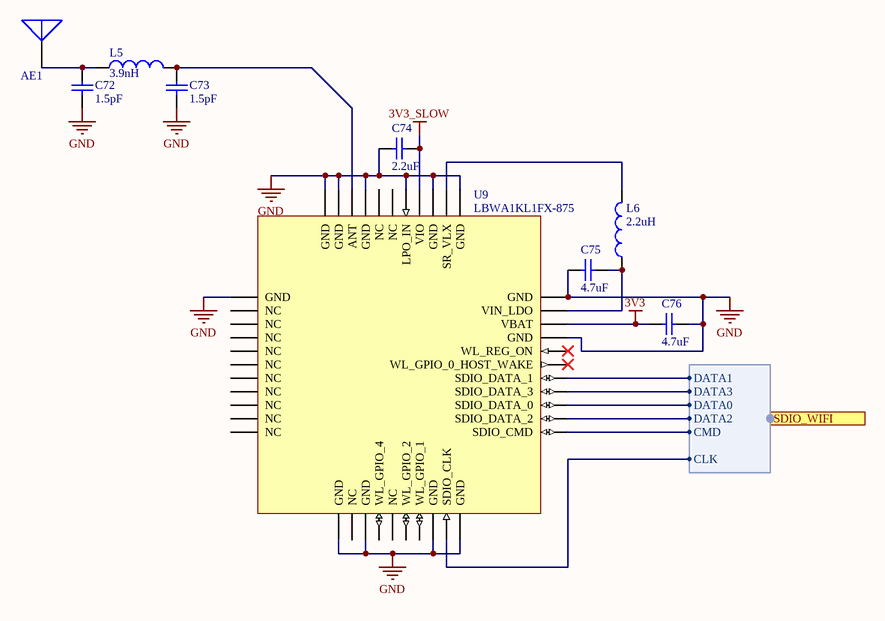
[diagram p5: WiFi.SchDoc]

### Parts
AE1  2450AT42A100E  [ANTENNA (3.2x1.6MM)]  (value not drawn)
C72  value 1.5pF  [C0402[1005X55]]  (hidden comment: 1.5pF 50V 0402)
C73  value 1.5pF  [C0402[1005X55]]  (hidden comment: 1.5pF 50V 0402)
C74  value 2.2uF  [C0402[1005X55]]  (hidden comment: 2.2uF 6.3V 0402)
C75  value 4.7uF  [C0402[1005X55]]  (hidden comment: 4.7uF 6.3V 0402)
C76  value 4.7uF  [C0402[1005X55]]  (hidden comment: 4.7uF 6.3V 0402)
L5  3.9nH  [IND0402]
L6  2.2uH  [IND0603]
U9  LBWA1KL1FX-875  [LGA-42]

### Ports
SDIO_WIFI (harness SDIO)

### Harnesses
SDIO: CLK, CMD, DATA0, DATA1, DATA2, DATA3

### Nets
3V3: C76.2 U9.30(VBAT)
3V3_SLOW: C74.1 U9.36(VIO)
GND: C72.1 C73.1 C74.2 C75.2 C76.1 U9.1(GND) U9.12(GND) U9.14(GND) U9.19(GND) U9.21(GND) U9.29(GND) U9.32(GND) U9.33(GND) U9.35(GND) U9.37(LPO_IN) U9.40(GND) U9.42(GND) U9.43(GND)
NetAE1_1: AE1.1 C72.2 L5.1
NetC73_2: C73.2 L5.2 U9.41(ANT)
NetC75_1: C75.1 L6.1 U9.31(VIN_LDO)
NetL6_2: L6.2 U9.34(SR_VLX)
NetR14_1: U9.22(SDIO_CMD) ; port SDIO_WIFI.CMD
NetR15_1: U9.24(SDIO_DATA_0) ; port SDIO_WIFI.DATA0
NetR16_1: U9.26(SDIO_DATA_1) ; port SDIO_WIFI.DATA1
NetR17_1: U9.23(SDIO_DATA_2) ; port SDIO_WIFI.DATA2
NetR18_1: U9.25(SDIO_DATA_3) ; port SDIO_WIFI.DATA3
NetR19_2: U9.20(SDIO_CLK) ; port SDIO_WIFI.CLK

Not connected (* = marked no-connect by the designer): U9 2(NC) 3(NC) 4(NC) 5(NC) 6(NC) 7(NC) 8(NC) 9(NC) 10(NC) 11(NC) 13(NC) 15(WL_GPIO_4) 16(NC) 17(WL_GPIO_2) 18(WL_GPIO_1) 27(WL_GPIO_0_HOST_WAKE)* 28(WL_REG_ON)* 38(NC) 39(NC)

### Library data of the parts
AE1 = 2450AT42A100E: Manufacturer: Johanson Technology Inc.; PartNumber: 2450AT42A100E; Mounting Technology: Surface Mount
C72 C73 = CAP_1.5pF_50V_0402_0.05pF: 1.5pF 50V 0.05pF 0402 (1005 Metric); PartNumber: GRM1555C1H1R5WA01D; Manufacturer: Murata; Mounting Technology: Surface Mount; PackageReference: 0402; PackageDescription: 0402 (1005 Metric); Voltage: 50V; Tolerance: 0.05pF
C74 = CAP_2.2uF_6.3V_0402_20%: as C144 on sheet Supplies; Mounting Technology: Surface Mount; PackageReference: 0402; PackageDescription: 0402 (1005 Metric); Voltage: 6.3V; Tolerance: 20%
C75 C76 = CAP_4.7uF_6.3V_0402_20%: as C29 on sheet MPU-Peripherals; Mounting Technology: Surface Mount; PackageReference: 0402; PackageDescription: 0402 (1005 Metric); Voltage: 6.3V; Tolerance: 20%
L5 = IND_3.9nH_0.3A_0402_0.3nH: 3.9nH +/-0.3nH 0.3A 0402; PartNumber: LQG15HS3N9S02D; Manufacturer: Murata; PackageReference: 0402; PackageDescription: 0402 (2012 metric); Mounting Technology: Surface Mount; Current: 0.3A; Value: 3.9nH
L6 = IND_2.2uH_750mA_0603_20%: as L2 on sheet Supplies; PackageReference: 0603; PackageDescription: 0603 (1608 metric); Mounting Technology: Surface Mount; Current: 750mA; Value: 2.2uH
U9 = LBWA1KL1FX-875: WI-FI-B/G/N NETWORK CONTROLLER; Manufacturer: Murata; PartNumber: LBWA1KL1FX-875; PackageReference: Module; Mounting Technology: Surface Mount